# EAGLE design InkTime_Schematic (EAGLE 9.7.0)
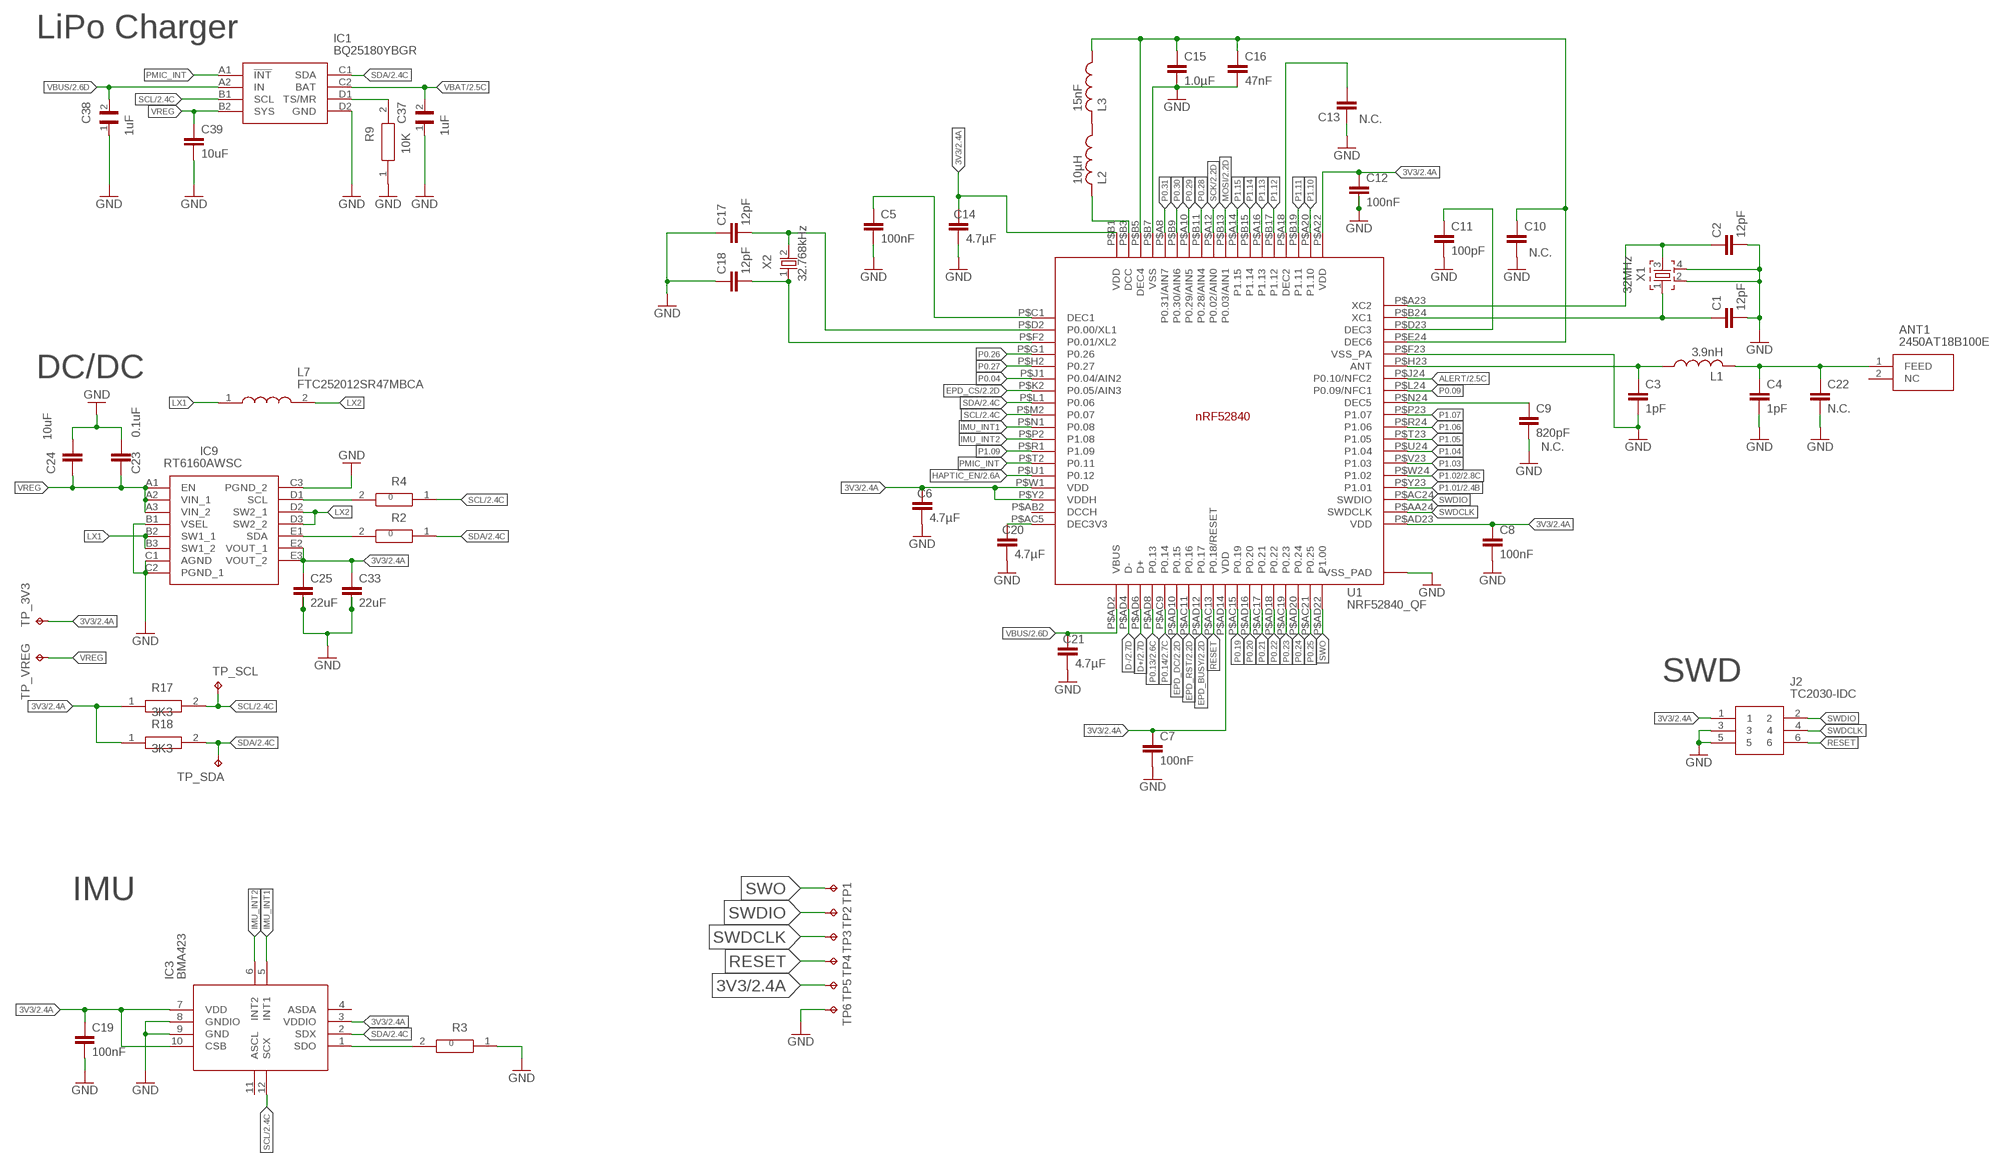
[diagram p0: schematic, sheet 1, part 1 of 2]
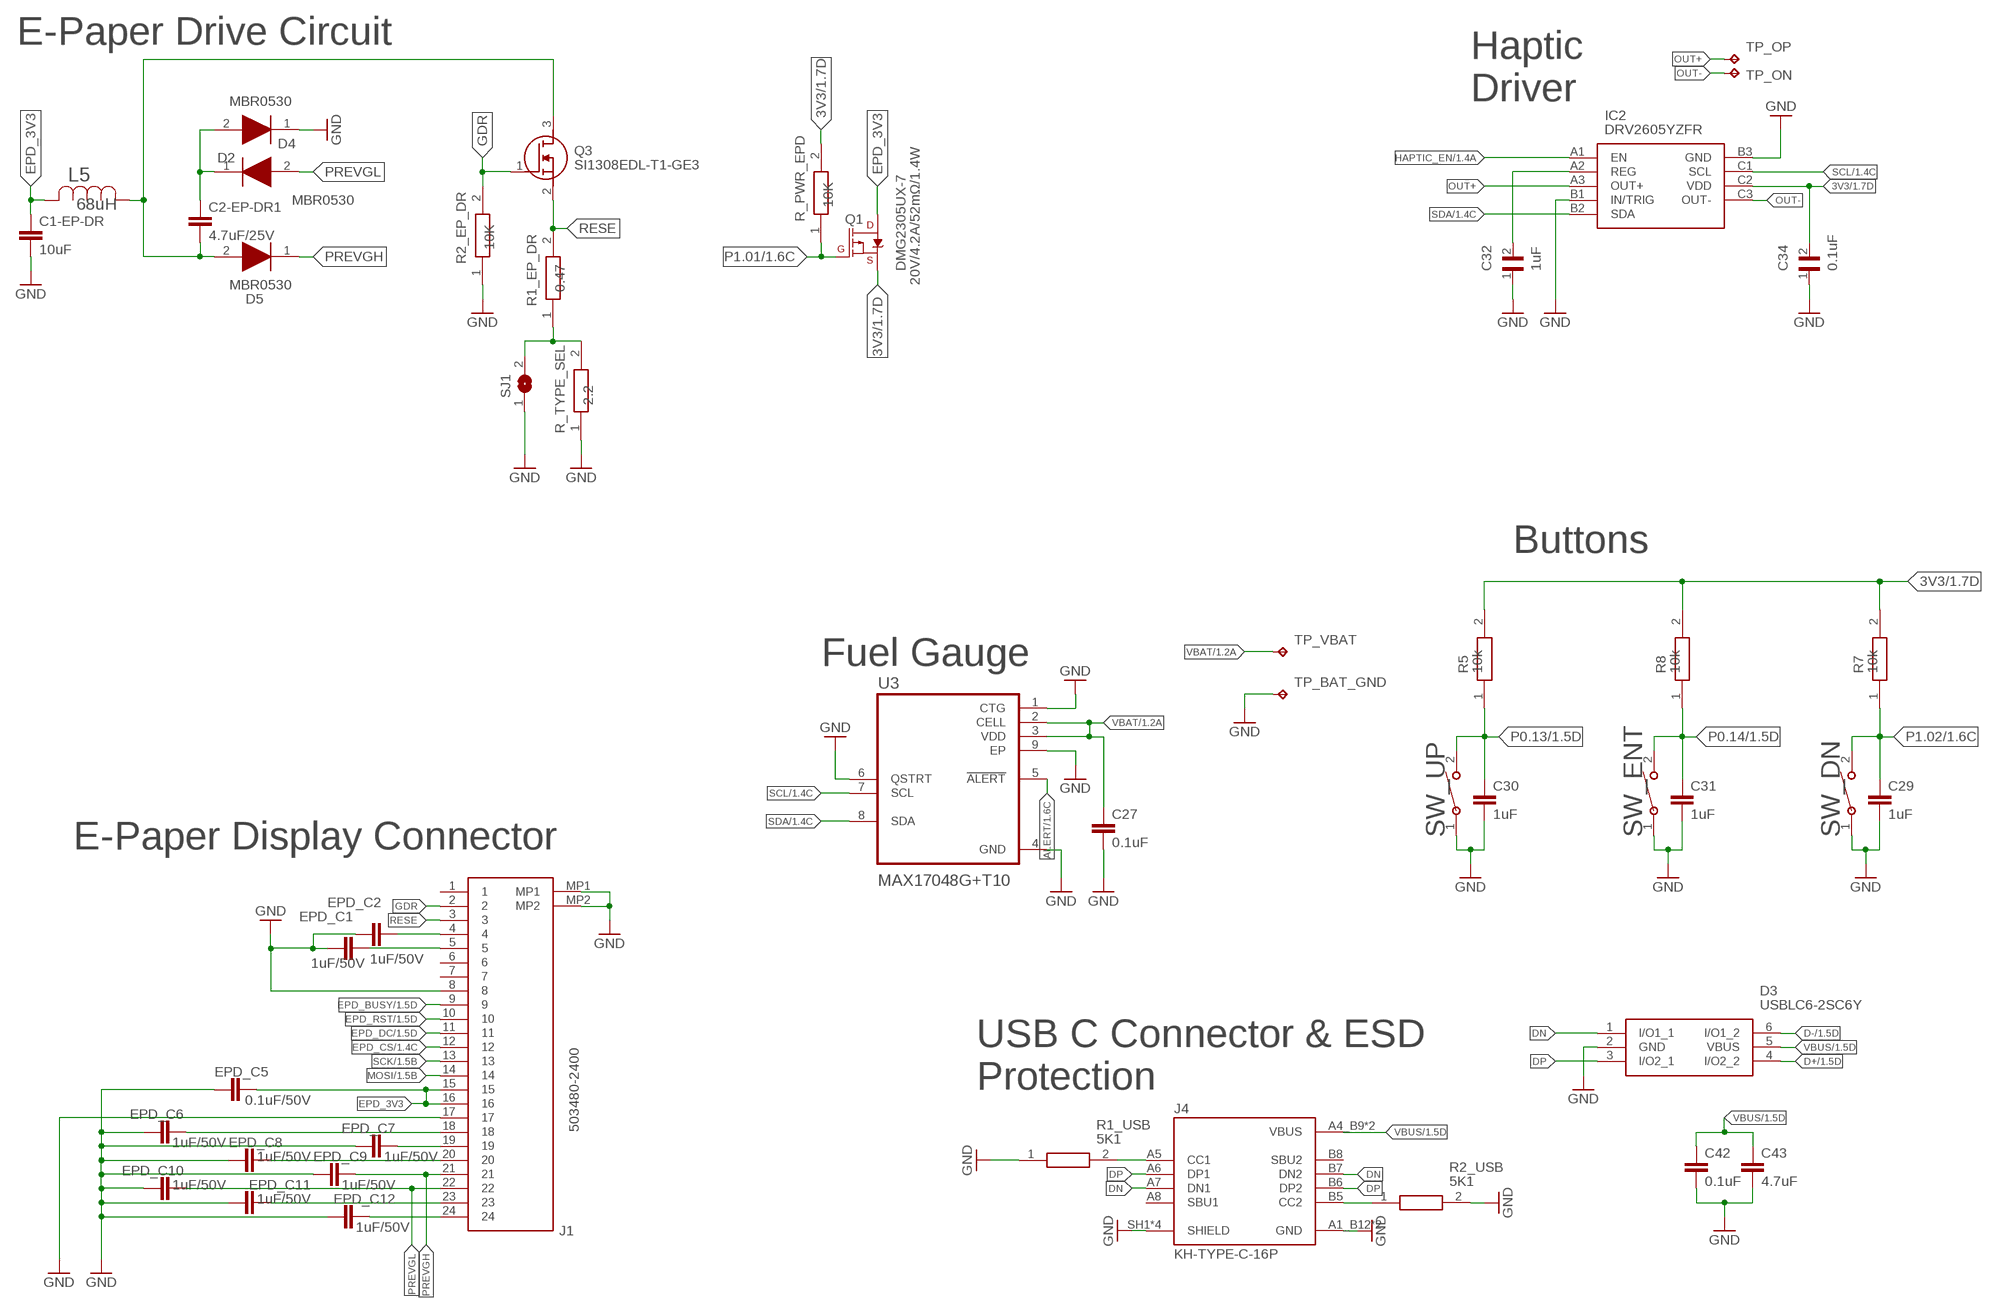
[diagram p1: schematic, sheet 1, part 2 of 2]

## Parts
ANT1  2450AT18B100E  2450AT18B100E_2450AT18B100E  [2450AT18B100E_ANTC3216X140N]
C1  12pF  NORDIC_NRF_3_CAPACITOR_0201_L  [NORDIC_NRF_3_RESC0201_L]
C1-EP-DR  10uF  NORDIC_NRF_3_CAPACITOR_0402_L  [NORDIC_NRF_3_RESC0402_L]
C2  12pF  NORDIC_NRF_3_CAPACITOR_0201_L  [NORDIC_NRF_3_RESC0201_L]
C2-EP-DR1  4.7uF/25V  NORDIC_NRF_3_CAPACITOR_0402_L  [NORDIC_NRF_3_RESC0402_L]
C3  1pF  NORDIC_NRF_3_CAPACITOR_0201_L  [NORDIC_NRF_3_RESC0201_L]
C4  1pF  NORDIC_NRF_3_CAPACITOR_0201_L  [NORDIC_NRF_3_RESC0201_L]
C5  100nF  NORDIC_NRF_3_CAPACITOR_0201_L  [NORDIC_NRF_3_RESC0201_L]
C6  4.7µF  NORDIC_NRF_3_CAPACITOR_0402_L  [NORDIC_NRF_3_RESC0402_L]
C7  100nF  NORDIC_NRF_3_CAPACITOR_0201_L  [NORDIC_NRF_3_RESC0201_L]
C8  100nF  NORDIC_NRF_3_CAPACITOR_0201_L  [NORDIC_NRF_3_RESC0201_L]
C9  820pF  NORDIC_NRF_3_CAPACITOR_0201_L  [NORDIC_NRF_3_RESC0201_L]
C10  NORDIC_NRF_3_CAPACITOR_0201_L  [NORDIC_NRF_3_RESC0201_L]
C11  100pF  NORDIC_NRF_3_CAPACITOR_0201_L  [NORDIC_NRF_3_RESC0201_L]
C12  100nF  NORDIC_NRF_3_CAPACITOR_0201_L  [NORDIC_NRF_3_RESC0201_L]
C13  NORDIC_NRF_3_CAPACITOR_0201_L  [NORDIC_NRF_3_RESC0201_L]
C14  4.7µF  NORDIC_NRF_3_CAPACITOR_0402_L  [NORDIC_NRF_3_RESC0402_L]
C15  1.0µF  NORDIC_NRF_3_CAPACITOR_0402_L  [NORDIC_NRF_3_RESC0402_L]
C16  47nF  NORDIC_NRF_3_CAPACITOR_0201_L  [NORDIC_NRF_3_RESC0201_L]
C17  12pF  NORDIC_NRF_3_CAPACITOR_0201_L  [NORDIC_NRF_3_RESC0201_L]
C18  12pF  NORDIC_NRF_3_CAPACITOR_0201_L  [NORDIC_NRF_3_RESC0201_L]
C19  100nF  NORDIC_NRF_3_CAPACITOR_0201_L  [NORDIC_NRF_3_RESC0201_L]
C20  4.7µF  NORDIC_NRF_3_CAPACITOR_0402_L  [NORDIC_NRF_3_RESC0402_L]
C21  4.7µF  NORDIC_NRF_3_CAPACITOR_0402_L  [NORDIC_NRF_3_RESC0402_L]
C22  N.C.  NORDIC_NRF_3_CAPACITOR_0201_L  [NORDIC_NRF_3_RESC0201_L]
C23  0.1uF  NORDIC_NRF_3_CAPACITOR_0201_L  [NORDIC_NRF_3_RESC0201_L]
C24  10uF  NORDIC_NRF_3_CAPACITOR_0402_L  [NORDIC_NRF_3_RESC0402_L]
C25  22uF  NORDIC_NRF_3_CAPACITOR_0402_L  [NORDIC_NRF_3_RESC0402_L]
C27  0.1uF  NORDIC_NRF_3_CAPACITOR_0201_L  [NORDIC_NRF_3_RESC0201_L]
C29  1uF  NORDIC_NRF_3_CAPACITOR_0402_L  [NORDIC_NRF_3_RESC0402_L]
C30  1uF  NORDIC_NRF_3_CAPACITOR_0402_L  [NORDIC_NRF_3_RESC0402_L]
C31  1uF  NORDIC_NRF_3_CAPACITOR_0402_L  [NORDIC_NRF_3_RESC0402_L]
C32  1uF  GRM011R60J152KE01L_2_GRM011R60J152KE01L  [GRM011R60J152KE01L_2_CAPC0201X13N]
C33  22uF  NORDIC_NRF_3_CAPACITOR_0402_L  [NORDIC_NRF_3_RESC0402_L]
C34  0.1uF  GRM011R60J152KE01L_2_GRM011R60J152KE01L  [GRM011R60J152KE01L_2_CAPC0201X13N]
C37  1uF  GRM011R60J152KE01L_2_GRM011R60J152KE01L  [GRM011R60J152KE01L_2_CAPC0201X13N]
C38  1uF  GRM011R60J152KE01L_2_GRM011R60J152KE01L  [GRM011R60J152KE01L_2_CAPC0201X13N]
C39  10uF  NORDIC_NRF_3_CAPACITOR_0402_L  [NORDIC_NRF_3_RESC0402_L]
C42  0.1uF  NORDIC_NRF_3_CAPACITOR_0201_L  [NORDIC_NRF_3_RESC0201_L]
C43  4.7uF  NORDIC_NRF_3_CAPACITOR_0402_L  [NORDIC_NRF_3_RESC0402_L]
D2  MBR0530  ESP32_C6_LIBRARY_5_MBR0530  [ESP32_C6_LIBRARY_5_SOD3716X135N]
D3  USBLC6-2SC6Y  ESP32_C6_LIBRARY_3_USBLC6-2SC6Y  [ESP32_C6_LIBRARY_3_SOT95P280X145-6N]
D4  MBR0530  ESP32_C6_LIBRARY_5_MBR0530  [ESP32_C6_LIBRARY_5_SOD3716X135N]
D5  MBR0530  ESP32_C6_LIBRARY_5_MBR0530  [ESP32_C6_LIBRARY_5_SOD3716X135N]
EPD_C1  1uF/50V  NORDIC_NRF_3_CAPACITOR_0402_L  [NORDIC_NRF_3_RESC0402_L]
EPD_C2  1uF/50V  NORDIC_NRF_3_CAPACITOR_0402_L  [NORDIC_NRF_3_RESC0402_L]
EPD_C5  0.1uF/50V  NORDIC_NRF_3_CAPACITOR_0201_L  [NORDIC_NRF_3_RESC0201_L]
EPD_C6  1uF/50V  NORDIC_NRF_3_CAPACITOR_0402_L  [NORDIC_NRF_3_RESC0402_L]
EPD_C7  1uF/50V  NORDIC_NRF_3_CAPACITOR_0402_L  [NORDIC_NRF_3_RESC0402_L]
EPD_C8  1uF/50V  NORDIC_NRF_3_CAPACITOR_0402_L  [NORDIC_NRF_3_RESC0402_L]
EPD_C9  1uF/50V  NORDIC_NRF_3_CAPACITOR_0402_L  [NORDIC_NRF_3_RESC0402_L]
EPD_C10  1uF/50V  NORDIC_NRF_3_CAPACITOR_0402_L  [NORDIC_NRF_3_RESC0402_L]
EPD_C11  1uF/50V  NORDIC_NRF_3_CAPACITOR_0402_L  [NORDIC_NRF_3_RESC0402_L]
EPD_C12  1uF/50V  NORDIC_NRF_3_CAPACITOR_0402_L  [NORDIC_NRF_3_RESC0402_L]
IC1  BQ25180YBGR  BQ25180YBGR_BQ25180YBGR  [BQ25180YBGR_BGA8C40P2X4_100X155X50]
IC2  DRV2605YZFR  DRV2605YZFR_DRV2605YZFR  [DRV2605YZFR_BGA9C50P3X3_144X144X62]
IC3  BMA423  BMA423_BMA423  [BMA423_BMA423]
IC9  RT6160AWSC  RT6160AWSC_RT6160AWSC  [RT6160AWSC_BGA15C40P3X5_140X230X60]
J1  503480-2400  503480-2400_503480-2400  [503480-2400_5034802400]
J2  TC2030-IDC  TC2030-IDC_TC2030-IDC  [TC2030-IDC_TC2030IDC]
J4  KH-TYPE-C-16P  KH-TYPE-C-16P_KH-TYPE-C-16P  [KH-TYPE-C-16P_KINGHELM_KH-TYPE-C-16P]
L1  3.9nH  NORDIC_NRF_2_INDUCTOR_0402_L  [NORDIC_NRF_2_RESC0402_L]
L2  10µH  NORDIC_NRF_2_INDUCTOR_0402_L  [NORDIC_NRF_2_RESC0402_L]
L3  15nF  NORDIC_NRF_2_INDUCTOR_0402_L  [NORDIC_NRF_2_RESC0402_L]
L5  68uH  ESP32_C6_LIBRARY_2_744043680IND_4828-WE-TPC_WRE  [ESP32_C6_LIBRARY_2_IND_4828-WE-TPC_WRE]
L7  FTC252012SR47MBCA  MLP2016SR47MT0S1_FTC252012SR47MBCA  [MLP2016SR47MT0S1_INDC2016X100N]
Q1  20V/4.2A/52mΩ/1.4W  ESP32_C6_LIBRARY_4_ESP32_WROVER_SPARKFUN-DISCRETESEMI_MOSFET_PCH-DMG2305UX-7  [ESP32_C6_LIBRARY_4_ESP32_C6_LIBRARY_4_ESP32_C6_LIBRARY_4_ESP32_C6_LIBRARY_4_ESP32_WROVER_SPARKFUN-DISCRETESEMI_SOT23-3]
Q3  SI1308EDL-T1-GE3  ESP32_C6_LIBRARY_6_SI1308EDL-T1-GE3  [ESP32_C6_LIBRARY_6_SOT65P210X110-3N]
R1_EP_DR  0.47  CPF0201D7K68C1_CPF0201D7K68C1  [CPF0201D7K68C1_0201]
R1_USB  5K1  ERA-1AEB3401C_CPF0201D7K68C1  [ERA-1AEB3401C_0201]
R2  CPF0201D7K68C1_CPF0201D7K68C1  [CPF0201D7K68C1_0201]
R2_EP_DR  10K  CPF0201D7K68C1_CPF0201D7K68C1  [CPF0201D7K68C1_0201]
R2_USB  5K1  ERA-1AEB3401C_CPF0201D7K68C1  [ERA-1AEB3401C_0201]
R3  CPF0201D7K68C1_CPF0201D7K68C1  [CPF0201D7K68C1_0201]
R4  CPF0201D7K68C1_CPF0201D7K68C1  [CPF0201D7K68C1_0201]
R5  10k  CPF0201D7K68C1_CPF0201D7K68C1  [CPF0201D7K68C1_0201]
R7  10k  CPF0201D7K68C1_CPF0201D7K68C1  [CPF0201D7K68C1_0201]
R8  10k  CPF0201D7K68C1_CPF0201D7K68C1  [CPF0201D7K68C1_0201]
R9  10K  CPF0201D7K68C1_CPF0201D7K68C1  [CPF0201D7K68C1_0201]
R17  3K3  CPF0201D7K68C1_CPF0201D7K68C1  [CPF0201D7K68C1_0201]
R18  3K3  CPF0201D7K68C1_CPF0201D7K68C1  [CPF0201D7K68C1_0201]
R_PWR_EPD  10K  CPF0201D7K68C1_CPF0201D7K68C1  [CPF0201D7K68C1_0201]
R_TYPE_SEL  2.2  CPF0201D7K68C1_CPF0201D7K68C1  [CPF0201D7K68C1_0201]
SJ1  ESP32_C6_LIBRARY_7_JUMPER_SJ  [ESP32_C6_LIBRARY_7_JUMPER_SJ]
SW_DN  2025-10-22_07-23-44_LIBRARY_EVP-AKE31ASW_EVP-AKE31A_PAN  [2025-10-22_07-23-44_LIBRARY_SW_EVP-AKE31A_PAN]
SW_ENT  SW_ENT  2025-10-22_07-23-44_LIBRARY_EVP-AKE31ASW_EVP-AKE31A_PAN  [2025-10-22_07-23-44_LIBRARY_SW_EVP-AKE31A_PAN]
SW_UP  2025-10-22_07-23-44_LIBRARY_EVP-AKE31ASW_EVP-AKE31A_PAN  [2025-10-22_07-23-44_LIBRARY_SW_EVP-AKE31A_PAN]
TP1  HECTOR_WATCH_1_TPTP20R  [HECTOR_WATCH_1_TP20R]
TP2  HECTOR_WATCH_1_TPTP20R  [HECTOR_WATCH_1_TP20R]
TP3  HECTOR_WATCH_1_TPTP20R  [HECTOR_WATCH_1_TP20R]
TP4  HECTOR_WATCH_1_TPTP20R  [HECTOR_WATCH_1_TP20R]
TP5  HECTOR_WATCH_1_TPTP20R  [HECTOR_WATCH_1_TP20R]
TP6  HECTOR_WATCH_1_TPTP20R  [HECTOR_WATCH_1_TP20R]
TP_3V3  HECTOR_WATCH_1_TPTP20R  [HECTOR_WATCH_1_TP20R]
TP_BAT_GND  HECTOR_WATCH_1_TPTP20R  [HECTOR_WATCH_1_TP20R]
TP_ON  HECTOR_WATCH_1_TPTP20R  [HECTOR_WATCH_1_TP20R]
TP_OP  HECTOR_WATCH_1_TPTP20R  [HECTOR_WATCH_1_TP20R]
TP_SCL  HECTOR_WATCH_1_TPTP20R  [HECTOR_WATCH_1_TP20R]
TP_SDA  HECTOR_WATCH_1_TPTP20R  [HECTOR_WATCH_1_TP20R]
TP_VBAT  HECTOR_WATCH_1_TPTP20R  [HECTOR_WATCH_1_TP20R]
TP_VREG  HECTOR_WATCH_1_TPTP20R  [HECTOR_WATCH_1_TP20R]
U1  NRF52840_QF  NORDIC_NRF_4_NRF52840_QF  [NORDIC_NRF_4_AQFN50P700X700X85_HS-74N]
U3  MAX17048G+T10  ESP32_C6_LIBRARY_MAX17048G+T10  [ESP32_C6_LIBRARY_SON50P200X200X80-9N]
X1  32MHz  NORDIC_NRF_XTAL_32MHZ  [NORDIC_NRF_BT-XTAL_2016_N]
X2  32.768kHz  NORDIC_NRF_1_XTAL_32KHZ  [NORDIC_NRF_1_XTAL_3215_N]

## Nets
3V3/1.7D [Power]: C34.2 IC2.C2(VDD) Q1.2(S) R5.2 R7.2 R8.2 R_PWR_EPD.2
3V3/2.4A [Power]: C6.1 C7.1 C8.1 C12.1 C14.1 C19.1 C25.1 C33.1 IC3.3(VDDIO) IC3.7(VDD) IC3.10(CSB) IC9.E2(VOUT_1) IC9.E3(VOUT_2) J2.1 R17.1 R18.1 TP5.TP TP_3V3.TP U1.P$A22(VDD) U1.P$AD14(VDD) U1.P$AD23(VDD) U1.P$B1(VDD) U1.P$W1(VDD) U1.P$Y2(VDDH)
ALERT/1.6C: U3.5(!ALERT)
ALERT/2.5C: U1.P$J24(P0.10/NFC2)
D+/1.5D: D3.4(I/O2_2)
D+/2.7D: U1.P$AD6(D+)
D-/1.5D: D3.6(I/O1_2)
D-/2.7D: U1.P$AD4(D-)
DN: D3.1(I/O1_1) J4.A7(DN1) J4.B7(DN2)
DP: D3.3(I/O2_1) J4.A6(DP1) J4.B6(DP2)
EPD_3V3 [Power]: C1-EP-DR.1 EPD_C5.2 J1.15 J1.16 L5.2 Q1.3(D)
EPD_BUSY/1.5D: J1.9
EPD_BUSY/2.2D: U1.P$AD12(P0.17)
EPD_CS/1.4C: J1.12
EPD_CS/2.2D: U1.P$K2(P0.05/AIN3)
EPD_DC/1.5D: J1.11
EPD_DC/2.2D: U1.P$AD10(P0.15)
EPD_RST/1.5D: J1.10
EPD_RST/2.2D: U1.P$AC11(P0.16)
GDR [Power]: J1.2 Q3.1(G) R2_EP_DR.2
GND [Power]: C1-EP-DR.2 C1.2 C2.2 C3.2 C4.2 C5.2 C6.2 C7.2 C8.2 C9.2 C10.1 C11.2 C12.2 C13.1 C14.2 C15.2 C16.2 C17.1 C18.1 C19.2 C20.2 C21.2 C22.2 C23.1 C24.1 C25.2 C27.2 C29.2 C30.2 C31.2 C32.1 C33.2 C34.1 C37.1 C38.1 C39.2 C42.2 C43.2 D2.1(K) D3.2(GND) EPD_C1.1 EPD_C2.1 EPD_C5.1 EPD_C6.1 EPD_C7.1 EPD_C8.1 EPD_C9.1 EPD_C10.1 EPD_C11.1 EPD_C12.1 IC1.D2(GND) IC2.B1(IN/TRIG) IC2.B3(GND) IC3.8(GNDIO) IC3.9(GND) IC9.B1(VSEL) IC9.C1(AGND) IC9.C2(PGND_1) IC9.C3(PGND_2) J1.8 J1.17 J1.MP1 J1.MP2 J2.3 J2.5 J4.A1_B12(GND) J4.A12_B1(GND) J4.SH1(SHIELD) J4.SH2(SHIELD) J4.SH3(SHIELD) J4.SH4(SHIELD) R1_USB.1 R2_EP_DR.1 R2_USB.2 R3.1 R9.1 R_TYPE_SEL.1 SJ1.1 SW_DN.1 SW_ENT.1 SW_UP.1 TP6.TP TP_BAT_GND.TP U1.P$74(VSS_PAD) U1.P$75(VSS_PAD) U1.P$76(VSS_PAD) U1.P$77(VSS_PAD) U1.P$78(VSS_PAD) U1.P$79(VSS_PAD) U1.P$80(VSS_PAD) U1.P$81(VSS_PAD) U1.P$82(VSS_PAD) U1.P$83(VSS_PAD) U1.P$84(VSS_PAD) U1.P$85(VSS_PAD) U1.P$86(VSS_PAD) U1.P$87(VSS_PAD) U1.P$88(VSS_PAD) U1.P$89(VSS_PAD) U1.P$90(VSS_PAD) U1.P$B7(VSS) U1.P$F23(VSS_PA) U3.1(CTG) U3.4(GND) U3.6(QSTRT) U3.9(EP) X1.2 X1.4
HAPTIC_EN/1.4A: IC2.A1(EN)
HAPTIC_EN/2.6A: U1.P$U1(P0.12)
IMU_INT1: IC3.5(INT1) U1.P$N1(P0.08)
IMU_INT2: IC3.6(INT2) U1.P$P2(P1.08)
LX1 [Power]: IC9.B2(SW1_1) IC9.B3(SW1_2) L7.1
LX2 [Power]: IC9.D2(SW2_1) IC9.D3(SW2_2) L7.2
MOSI/1.5B: J1.14
MOSI/2.2D: U1.P$B13(P0.03/AIN1)
N$1: C5.1 U1.P$C1(DEC1)
N$2: C9.1 U1.P$N24(DEC5)
N$3: C11.1 U1.P$D23(DEC3)
N$4: IC9.D1(SCL) R4.2
N$5: C17.2 U1.P$D2(P0.00/XL1) X2.2
N$6: C18.2 U1.P$F2(P0.01/XL2) X2.1
N$7: C2-EP-DR1.2 D5.2(A) L5.1 Q3.3(D)
N$9: C3.1 L1.1 U1.P$H23(ANT)
N$10: ANT1.1(FEED) C4.1 C22.1 L1.2
N$12: C10.2 C15.1 C16.1 L3.1 U1.P$B5(DEC4) U1.P$E24(DEC6)
N$13: C2.1 U1.P$A23(XC2) X1.3
N$14: C1.1 U1.P$B24(XC1) X1.1
N$15: L2.1 L3.2
N$16: L2.2 U1.P$B3(DCC)
N$17: C13.2 U1.P$A18(DEC2)
N$18: IC3.1(SDO) R3.2
N$19: C20.1 U1.P$AC5(DEC3V3)
N$21: IC9.E1(SDA) R2.2
N$23: EPD_C8.2 J1.20
N$24: IC1.D1(TS/MR) R9.2
N$25: C2-EP-DR1.1 D2.2(A) D4.1(K)
N$27: EPD_C2.2 J1.4
N$29: R1_EP_DR.1 R_TYPE_SEL.2 SJ1.2
N$31: EPD_C1.2 J1.5
N$32: C32.2 IC2.A2(REG)
N$34: J4.B5(CC2) R2_USB.1
N$37: J4.A5(CC1) R1_USB.2
N$39: EPD_C7.2 J1.19
N$41: EPD_C6.2 J1.18
N$42: EPD_C11.2 J1.23
N$44: EPD_C12.2 J1.24
OUT+ [Power]: IC2.A3(OUT+) TP_OP.TP
OUT- [Power]: IC2.C3(OUT-) TP_ON.TP
P0.04: U1.P$J1(P0.04/AIN2)
P0.09: U1.P$L24(P0.09/NFC1)
P0.13/1.5D: C30.1 R5.1 SW_UP.2
P0.13/2.6C: U1.P$AD8(P0.13)
P0.14/1.5D: C31.1 R8.1 SW_ENT.2
P0.14/2.7C: U1.P$AC9(P0.14)
P0.19: U1.P$AC15(P0.19)
P0.20: U1.P$AD16(P0.20)
P0.21: U1.P$AC17(P0.21)
P0.22: U1.P$AD18(P0.22)
P0.23: U1.P$AC19(P0.23)
P0.24: U1.P$AD20(P0.24)
P0.25: U1.P$AC21(P0.25)
P0.26: U1.P$G1(P0.26)
P0.27: U1.P$H2(P0.27)
P0.28: U1.P$B11(P0.28/AIN4)
P0.29: U1.P$A10(P0.29/AIN5)
P0.30: U1.P$B9(P0.30/AIN6)
P0.31: U1.P$A8(P0.31/AIN7)
P1.01/1.6C: Q1.1(G) R_PWR_EPD.1
P1.01/2.4B: U1.P$Y23(P1.01)
P1.02/1.6C: C29.1 R7.1 SW_DN.2
P1.02/2.8C: U1.P$W24(P1.02)
P1.03: U1.P$V23(P1.03)
P1.04: U1.P$U24(P1.04)
P1.05: U1.P$T23(P1.05)
P1.06: U1.P$R24(P1.06)
P1.07: U1.P$P23(P1.07)
P1.09: U1.P$R1(P1.09)
P1.10: U1.P$A20(P1.10)
P1.11: U1.P$B19(P1.11)
P1.12: U1.P$B17(P1.12)
P1.13: U1.P$A16(P1.13)
P1.14: U1.P$B15(P1.14)
P1.15: U1.P$A14(P1.15)
PMIC_INT: IC1.A1(!INT) U1.P$T2(P0.11)
PREVGH [Power]: D5.1(K) EPD_C9.2 J1.21
PREVGL [Power]: D4.2(A) EPD_C10.2 J1.22
RESE [Power]: J1.3 Q3.2(S) R1_EP_DR.2
RESET: J2.6 TP4.TP U1.P$AC13(P0.18/RESET)
SCK/1.5B: J1.13
SCK/2.2D: U1.P$A12(P0.02/AIN0)
SCL/1.4C: IC2.C1(SCL) U3.7(SCL)
SCL/2.4C: IC1.B1(SCL) IC3.12(SCX) R4.1 R17.2 TP_SCL.TP U1.P$M2(P0.07)
SDA/1.4C: IC2.B2(SDA) U3.8(SDA)
SDA/2.4C: IC1.C1(SDA) IC3.2(SDX) R2.1 R18.2 TP_SDA.TP U1.P$L1(P0.06)
SWDCLK: J2.4 TP3.TP U1.P$AA24(SWDCLK)
SWDIO: J2.2 TP2.TP U1.P$AC24(SWDIO)
SWO: TP1.TP U1.P$AD22(P1.00)
VBAT/1.2A [Power]: C27.1 TP_VBAT.TP U3.2(CELL) U3.3(VDD)
VBAT/2.5C [Power]: C37.2 IC1.C2(BAT)
VBUS/1.5D [Power]: C42.1 C43.1 D3.5(VBUS) J4.A4_B9(VBUS) J4.A9_B4(VBUS)
VBUS/2.6D [Power]: C21.1 C38.2 IC1.A2(IN) U1.P$AD2(VBUS)
VREG [Power]: C23.2 C24.2 C39.1 IC1.B2(SYS) IC9.A1(EN) IC9.A2(VIN_1) IC9.A3(VIN_2) TP_VREG.TP
Unconnected: ANT1.2(NC) IC3.4(ASDA) IC3.11(ASCL) J1.1 J1.6 J1.7 J4.A8(SBU1) J4.B8(SBU2) U1.P$AB2(DCCH)

## Notes on the sheet
- LiPo Charger
- N.C.
- N.C.
- DC/DC
- N.C.
- 0
- 0
- SWD
- IMU
- 0
- E-Paper Drive Circuit
- Haptic
  Driver
- DMG2305UX-7
- Buttons
- Fuel Gauge
- E-Paper Display Connector
- USB C Connector & ESD
  Protection

## Library data of the parts
ANT1 = InkTime_v5:2450AT18B100E_2450AT18B100E: Antennas 2.45GHz ANTENNA Source: Datasheet <https://www.johansontechnology.com/datasheets/2450AT18B100/2450AT18B100.pdf>; ARROW_PART_NUMBER: 2450AT18B100E; ARROW_PRICE-STOCK: https://www.arrow.com/en/products/2450at18b100e/johanson-dielectrics?utm_currency=USD&region=nac; DESCRIPTION: Antennas 2.45GHz ANTENNA; HEIGHT: 1.4mm; MANUFACTURER_NAME: JOHANSON TECHNOLOGY; MANUFACTURER_PART_NUMBER: 2450AT18B100E; MOUSER_PART_NUMBER: 609-2450AT18B100E; MOUSER_PRICE-STOCK: https://www.mouser.co.uk/ProductDetail/Johanson-Technology/2450AT18B100E?qs=yCnrNFeXz%252Bh5MFsFIXGZGA%3D%3D
C1 C1-EP-DR C2 C2-EP-DR1 C3-C25 C27 C29-C31 C33 C39 C42 C43 EPD_C1 EPD_C2 EPD_C5-EPD_C12 = InkTime_v5:NORDIC_NRF_3_CAPACITOR: Generic chip capacitor
C32 C34 C37 C38 = InkTime_v5:GRM011R60J152KE01L_2_GRM011R60J152KE01L: Check availability <https://pricing.snapeda.com/parts/GRM011R60J152KE01L/Murata/view-part?ref=eda>; AVAILABILITY: In Stock; CHECK_PRICES: https://www.snapeda.com/parts/GRM011R60J152KE01L/Murata/view-part/?ref=eda; DESCRIPTION: SMD Capacitor X5R(EIA) with Capacitance: 1500pF Tol. 10%. Rated Voltage: 6.3Vdc; MF: Murata; MP: GRM011R60J152KE01L; PACKAGE: 0201 Murata; PRICE: None; SNAPEDA_LINK: https://www.snapeda.com/parts/GRM011R60J152KE01L/Murata/view-part/?ref=snap
D2 D4 D5 = InkTime_v5:ESP32_C6_LIBRARY_5_MBR0530: ON SEMICONDUCTOR - MBR0530 - DIODE, SCHOTTKY, 0.5A, 30V, SOD-123 Source: Datasheet <http://www.onsemi.com/pub/Collateral/MBR0530T1-D.PDF> Check availability <https://pricing.snapeda.com/parts/MBR0530/ON%20Semiconductor/view-part?ref=eda>; AVAILABILITY: In Stock; CHECK_PRICES: https://www.snapeda.com/parts/MBR0530/Onsemi/view-part/?ref=eda; DESCRIPTION: Diode Schottky 30 V 500mA Surface Mount SOD-123; MF: ON Semiconductor; MP: MBR0530; PACKAGE: SOD-123-2 ON Semiconductor; PRICE: None; PURCHASE-URL: https://www.snapeda.com/api/url_track_click_mouser/?unipart_id=179458&manufacturer=ON Semiconductor&part_name=MBR0530&search_term=None; SNAPEDA_LINK: https://www.snapeda.com/parts/MBR0530/Onsemi/view-part/?ref=snap
D3 = InkTime_v5:ESP32_C6_LIBRARY_3_USBLC6-2SC6Y: Low Cap. ESD Protection Auto SOT-23-6 STMicroelectronics USBLC6-2SC6Y, Dual Uni-Directional TVS Diode Array, 6-Pin SOT-23 Source: Datasheet <https://componentsearchengine.com/Datasheets/1/USBLC6-2SC6Y.pdf> Check availability <https://pricing.snapeda.com/parts/USBLC6-2SC6Y/STMicroelectronics/view-part?ref=eda>; AVAILABILITY: In Stock; CHECK_PRICES: https://www.snapeda.com/parts/USBLC6-2SC6Y/STMicroelectronics/view-part/?ref=eda; DESCRIPTION: 17V Clamp 5A (8/20µs) Ipp Tvs Diode Surface Mount SOT-23-6; MF: STMicroelectronics; MP: USBLC6-2SC6Y; PACKAGE: SOT-23-6 STMicroelectronics; PRICE: None; SNAPEDA_LINK: https://www.snapeda.com/parts/USBLC6-2SC6Y/STMicroelectronics/view-part/?ref=snap
IC1 = InkTime_v5:BQ25180YBGR_BQ25180YBGR: Charger IC Lithium Ion/Polymer, Lithium Iron Phosphate 8-DSBGA (1.6x1.1) Source: Datasheet <https://www.ti.com/lit/ds/symlink/bq25180.pdf?ts=1650264094470&ref_url=https%3A%2F%2Fwww.ti.com%2Fproduct%2FBQ25180>; ARROW_PART_NUMBER: BQ25180YBGR; ARROW_PRICE-STOCK: https://www.arrow.com/en/products/bq25180ybgr/texas-instruments?utm_currency=USD&region=nac; DESCRIPTION: Charger IC Lithium Ion/Polymer, Lithium Iron Phosphate 8-DSBGA (1.6x1.1); HEIGHT: 0.5mm; MANUFACTURER_NAME: Texas Instruments; MANUFACTURER_PART_NUMBER: BQ25180YBGR; MOUSER_PART_NUMBER: 595-BQ25180YBGR; MOUSER_PRICE-STOCK: https://www.mouser.co.uk/ProductDetail/Texas-Instruments/BQ25180YBGR?qs=doiCPypUmgEWjAK%252BJAX6Tw%3D%3D
IC2 = InkTime_v5:DRV2605YZFR_DRV2605YZFR: Haptic Driver for ERM/LRA with Built-In Library and Smart Loop Architecture Source: Datasheet <http://www.ti.com/lit/gpn/drv2605>; ARROW_PART_NUMBER: DRV2605YZFR; ARROW_PRICE-STOCK: https://www.arrow.com/en/products/drv2605yzfr/texas-instruments?region=nac; DESCRIPTION: Haptic Driver for ERM/LRA with Built-In Library and Smart Loop Architecture; HEIGHT: 0.625mm; MANUFACTURER_NAME: Texas Instruments; MANUFACTURER_PART_NUMBER: DRV2605YZFR
IC3 = InkTime_v5:BMA423_BMA423: Accelerometers Triaxial low-g 12bit Acceleration Sensor Source: Datasheet <https://www.mouser.com/datasheet/2/783/BST-BMA423-DS000-1509600.pdf>; ARROW_PART_NUMBER: BMA423; ARROW_PRICE-STOCK: https://www.arrow.com/en/products/bma423/bosch; DESCRIPTION: Accelerometers Triaxial low-g 12bit Acceleration Sensor; HEIGHT: 1mm; MANUFACTURER_NAME: BOSCH; MANUFACTURER_PART_NUMBER: BMA423; MOUSER_PART_NUMBER: 262-BMA423; MOUSER_PRICE-STOCK: https://www.mouser.co.uk/ProductDetail/Bosch-Sensortec/BMA423?qs=HXFqYaX1Q2xC%252BSgeGoX3mg%3D%3D
IC9 = InkTime_v5:RT6160AWSC_RT6160AWSC: Buck-Boost Regulator Positive Output Step-Up/Step-Down I2C DC-DC Controller IC 15-WL-CSP (BSC) (1.4x2.3) Source: Datasheet <https://www.richtek.com/SaveDownload.aspx?specid=RT6160A>; DESCRIPTION: Buck-Boost Regulator Positive Output Step-Up/Step-Down I2C DC-DC Controller IC 15-WL-CSP (BSC) (1.4x2.3); HEIGHT: 0.6mm; MANUFACTURER_NAME: RICHTEK; MANUFACTURER_PART_NUMBER: RT6160AWSC; MOUSER_PART_NUMBER: 835-RT6160AWSC; MOUSER_PRICE-STOCK: https://www.mouser.co.uk/ProductDetail/Richtek/RT6160AWSC?qs=amGC7iS6iy%2FLd9PSoixZXQ%3D%3D
J1 = InkTime_v5:503480-2400_503480-2400: FFC & FPC Connectors 0.5mm FPC RA SMT Dual Contact 24Ckt Source: Datasheet <https://componentsearchengine.com/Datasheets/1/503480-2400.pdf>; DESCRIPTION: FFC & FPC Connectors 0.5mm FPC RA SMT Dual Contact 24Ckt; HEIGHT: 1.87mm; MANUFACTURER_NAME: Molex; MANUFACTURER_PART_NUMBER: 503480-2400; MOUSER_PART_NUMBER: 538-503480-2400; MOUSER_PRICE-STOCK: https://www.mouser.co.uk/ProductDetail/Molex/503480-2400?qs=OAhjpuo3Vu7efIoxFh9AOw%3D%3D
J2 = InkTime_v5:TC2030-IDC_TC2030-IDC: CABLE ADAPTER 6 POS Source: Datasheet <https://datasheet.datasheetarchive.com/originals/distributors/Datasheets_SAMA/62bc384e093448baaaa63dbd0b9d8707.pdf>; DESCRIPTION: CABLE ADAPTER 6 POS; HEIGHT: 19mm; MANUFACTURER_NAME: Tag Connect; MANUFACTURER_PART_NUMBER: TC2030-IDC
J4 = InkTime_v5:KH-TYPE-C-16P_KH-TYPE-C-16P: Check availability <https://pricing.snapeda.com/parts/KH-TYPE-C-16P/kinghelm/view-part?ref=eda>; AVAILABILITY: Not in stock; CHECK_PRICES: https://www.snapeda.com/parts/KH-TYPE-C-16P/Kinghelm/view-part/?ref=eda; MF: kinghelm; MP: KH-TYPE-C-16P; PACKAGE: None; PRICE: None; SNAPEDA_LINK: https://www.snapeda.com/parts/KH-TYPE-C-16P/Kinghelm/view-part/?ref=snap
L1-L3 = InkTime_v5:NORDIC_NRF_2_INDUCTOR: Generic chip inductor
L5 = InkTime_v5:ESP32_C6_LIBRARY_2_744043680; COPYRIGHT: Copyright (C) 2024 Ultra Librarian. All rights reserved.; MANUFACTURER_PART_NUMBER: 744043680; MFR_NAME: Wurth Electronics
L7 = InkTime_v5:MLP2016SR47MT0S1_FTC252012SR47MBCA: SMD / SMT Inductors (Coils), L=0.47?H, L x W x T : Source: Datasheet <https://product.tdk.com/system/files/dam/doc/product/inductor/inductor/smd/catalog/inductor_commercial_power_mlp2016_en.pdf>; DESCRIPTION: SMD / SMT Inductors (Coils), L=0.47?H, L x W x T :; HEIGHT: 1mm; JLCPCB: https://jlcpcb.com/partdetail/6763488-FTC252012SR47MBCA/C5832368; MANUFACTURER_NAME: TDK; MANUFACTURER_PART_NUMBER: FTC252012SR47MBCA
Q1 = InkTime_v5:ESP32_C6_LIBRARY_4_ESP32_WROVER_SPARKFUN-DISCRETESEMI_MOSFET_PCH: P-channel MOSFETs Voltage controlled devices that allow control of high current outputs. SparkFun Products: SparkFun ESP32 Thing <https://www.sparkfun.com/products/13907> SparkFun ESP8266 Thing <https://www.sparkfun.com/products/13231> SparkFun Pi Servo HAT V2 <https://www.sparkfun.com/products/15316> DMG2305UX-7 (20V/4.2A/SOT23-3); PROD_ID: TRAN-14388
Q3 = InkTime_v5:ESP32_C6_LIBRARY_6_SI1308EDL-T1-GE3: MOSFET N-Ch 30V 1.5A TrenchFET SC70 Vishay Si1308EDL-T1-GE3 N-channel MOSFET Transistor, 1.5 A, 30 V, 3-Pin SC-70 Source: Datasheet <https://componentsearchengine.com/Datasheets/1/SI1308EDL-T1-GE3.pdf> Check availability <https://pricing.snapeda.com/parts/SI1308EDL-T1-GE3/Vishay%20Siliconix/view-part?ref=eda>; AVAILABILITY: In Stock; CHECK_PRICES: https://www.snapeda.com/parts/SI1308EDL-T1-GE3/Vishay+Siliconix/view-part/?ref=eda; DESCRIPTION: Si1308EDL-T1-GE3 N-channel MOSFET Transistor, 1.5 A, 30 V, 3-Pin SC-70 | Siliconix / Vishay SI1308EDL-T1-GE3; MF: Vishay Siliconix; MP: SI1308EDL-T1-GE3; PACKAGE: SOT-323 Vishay Semiconductor; PRICE: None; PURCHASE-URL: https://www.snapeda.com/api/url_track_click_mouser/?unipart_id=274603&manufacturer=Vishay Siliconix&part_name=SI1308EDL-T1-GE3&search_term=None; SNAPEDA_LINK: https://www.snapeda.com/parts/SI1308EDL-T1-GE3/Vishay+Siliconix/view-part/?ref=snap
R1_EP_DR R2 R2_EP_DR R3-R5 R7-R9 R17 R18 R_PWR_EPD R_TYPE_SEL = InkTime_v5:CPF0201D7K68C1_CPF0201D7K68C1: 7.68k 0201 Thin Film Surface Mount Fixed Resistor +/-0.5% 0.031W CPF0201D7K68C1 Source: Datasheet <http://www.te.com/commerce/DocumentDelivery/DDEController?Action=showdoc&DocId=Data Sheet1773200-1ApdfEnglishENG_DS_1773200-1_A.pdf4-2176215-6>
R1_USB R2_USB = InkTime_v5:ERA-1AEB3401C_CPF0201D7K68C1: 7.68k 0201 Thin Film Surface Mount Fixed Resistor +/-0.5% 0.031W CPF0201D7K68C1 Source: Datasheet <http://www.te.com/commerce/DocumentDelivery/DDEController?Action=showdoc&DocId=Data Sheet1773200-1ApdfEnglishENG_DS_1773200-1_A.pdf4-2176215-6>
SJ1 = InkTime_v5:ESP32_C6_LIBRARY_7_JUMPER_SJ: SMD solder JUMPER
SW_DN SW_ENT SW_UP = InkTime_v5:2025-10-22_07-23-44_LIBRARY_EVP-AKE31A; COPYRIGHT: Copyright (C) 2025 Ultra Librarian. All rights reserved.; DIGI-KEY_PART_NUMBER_1: P123437TR-ND; DIGI-KEY_PART_NUMBER_2: P123437CT-ND; DIGI-KEY_PART_NUMBER_3: P123437DKR-ND; MANUFACTURER_NAME: Panasonic; MANUFACTURER_PART_NUMBER: EVP-AKE31A
TP1-TP6 TP_3V3 TP_BAT_GND TP_ON TP_OP TP_SCL TP_SDA TP_VBAT TP_VREG = InkTime_v5:HECTOR_WATCH_1_TP: Test pad
U1 = InkTime_v5:NORDIC_NRF_4_NRF52840_QF: nRF52840 Features Advanced Single chip 2.4 GHz multi-protocol SoC 32-bit ARM Cortex-M4F Processor 1.7v to 5.5v operation 1MB flash + 256kB RAM Bluetooth 5 support for long range and high throughput 802.15.4 radio support On-chip NFC PPI –Programmable Peripheral Interconnect Automated power management system with automatic power management of each peripheral Configurable I/O mapping for analog and digital I/O 48 x GPIO 1 x QSPI 4 x Master/Slave SPI 2 x Two-wire interface (I²C) I²S interface 2 x UART 4 x PWM USB 2.0 controller ARM TrustZone CryptoCell-310 Cryptographic and security module AES 128-bit ECB/CCM/AAR hardware accelerator Digital microphone interface (PDM) Quadrature decoder 12-bit ADC Low power comparator On-chip 50Ω balun On-air compatible with nRF52, nRF51 and nRF24 Series Applications Advanced high performance wearables Wearables for secure payments Virtual Reality/Augmented Reality systems Smart Home sensor networks Smart city sensor networks High performance HID controllers Internet of Things (IoT) sensor networks Smart door locks Smart lighting networks Connected white goods
U3 = InkTime_v5:ESP32_C6_LIBRARY_MAX17048G+T10: Check availability <https://pricing.snapeda.com/parts/MAX17048G%2BT10/Analog%20Devices/view-part?ref=eda>; AVAILABILITY: In Stock; CHECK_PRICES: https://www.snapeda.com/parts/MAX17048G+T10/Analog+Devices/view-part/?ref=eda; DESCRIPTION: 3µA 1-Cell/2-Cell Fuel Gauge with ModelGauge; MF: Analog Devices; MP: MAX17048G+T10; PACKAGE: TDFN-8 Maxim; PRICE: None; PURCHASE-URL: https://www.snapeda.com/api/url_track_click_mouser/?unipart_id=329239&manufacturer=Analog Devices&part_name=MAX17048G+T10&search_term=None; SNAPEDA_LINK: https://www.snapeda.com/parts/MAX17048G+T10/Analog+Devices/view-part/?ref=snap
X1 = InkTime_v5:NORDIC_NRF_XTAL_32MHZ
X2 = InkTime_v5:NORDIC_NRF_1_XTAL_32KHZ

## Net classes
1 Power: width 0.3 mm

## Board
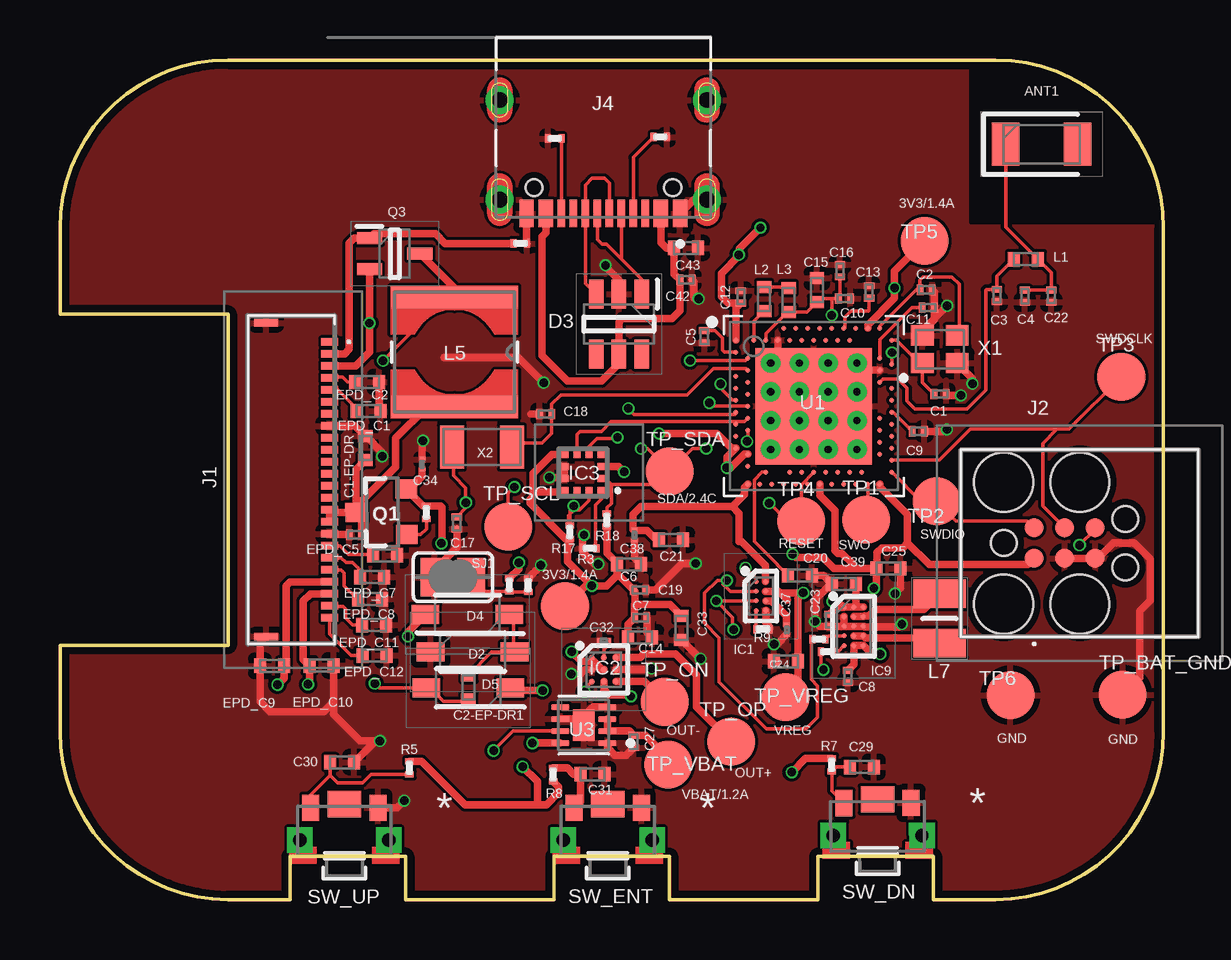
[diagram p2: board, top side]
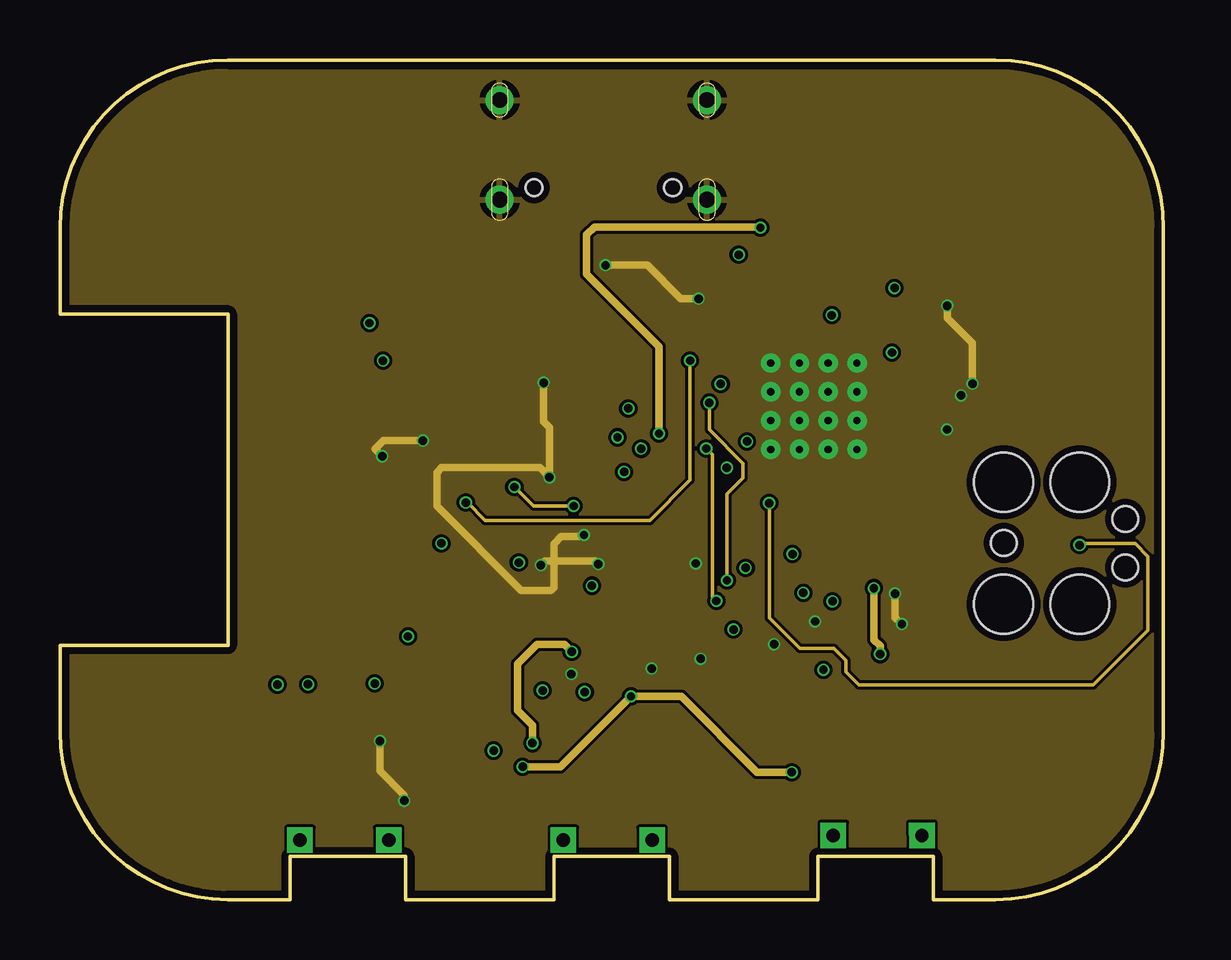
[diagram p3: board, inner layer Route2]
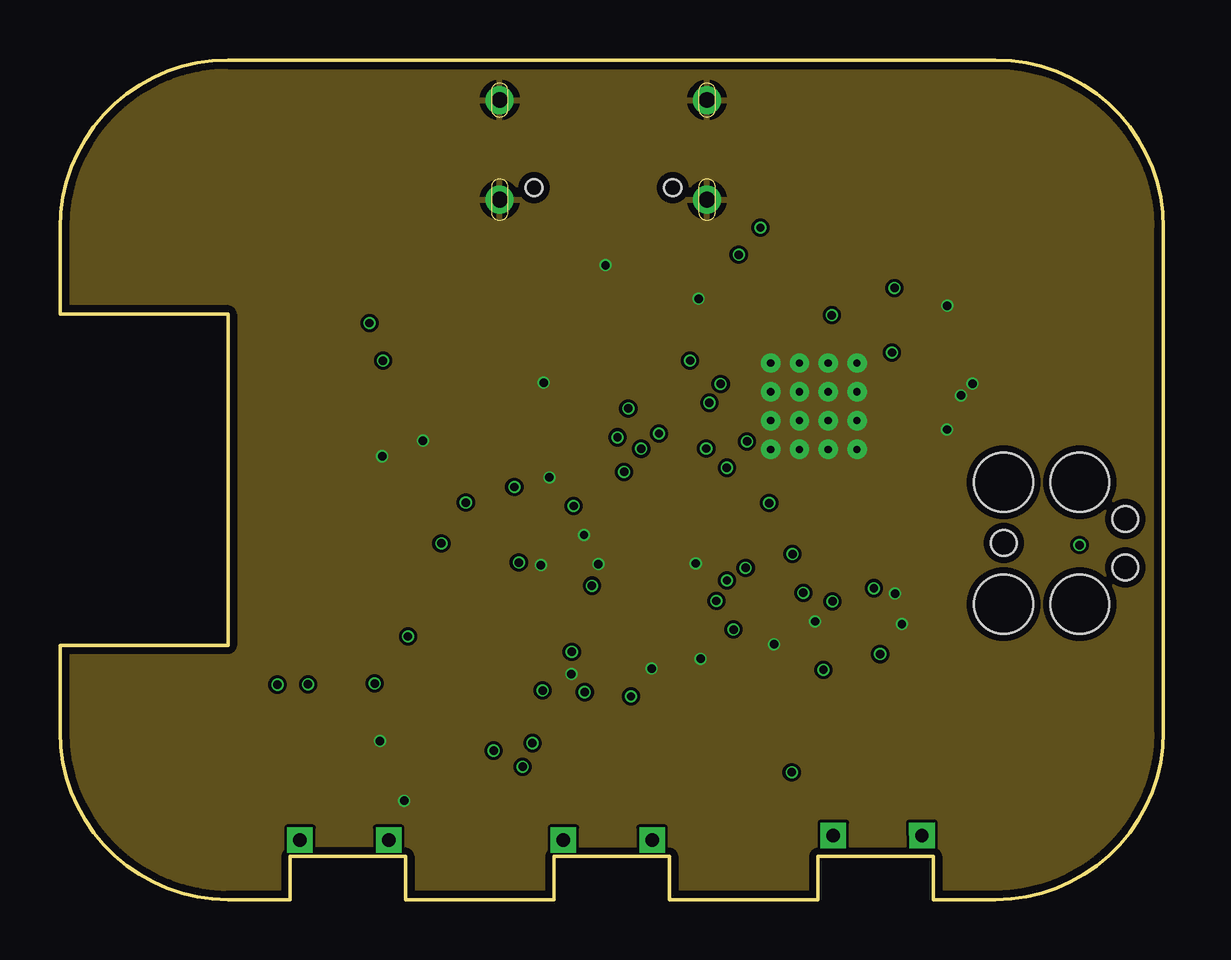
[diagram p4: board, inner layer Route15]
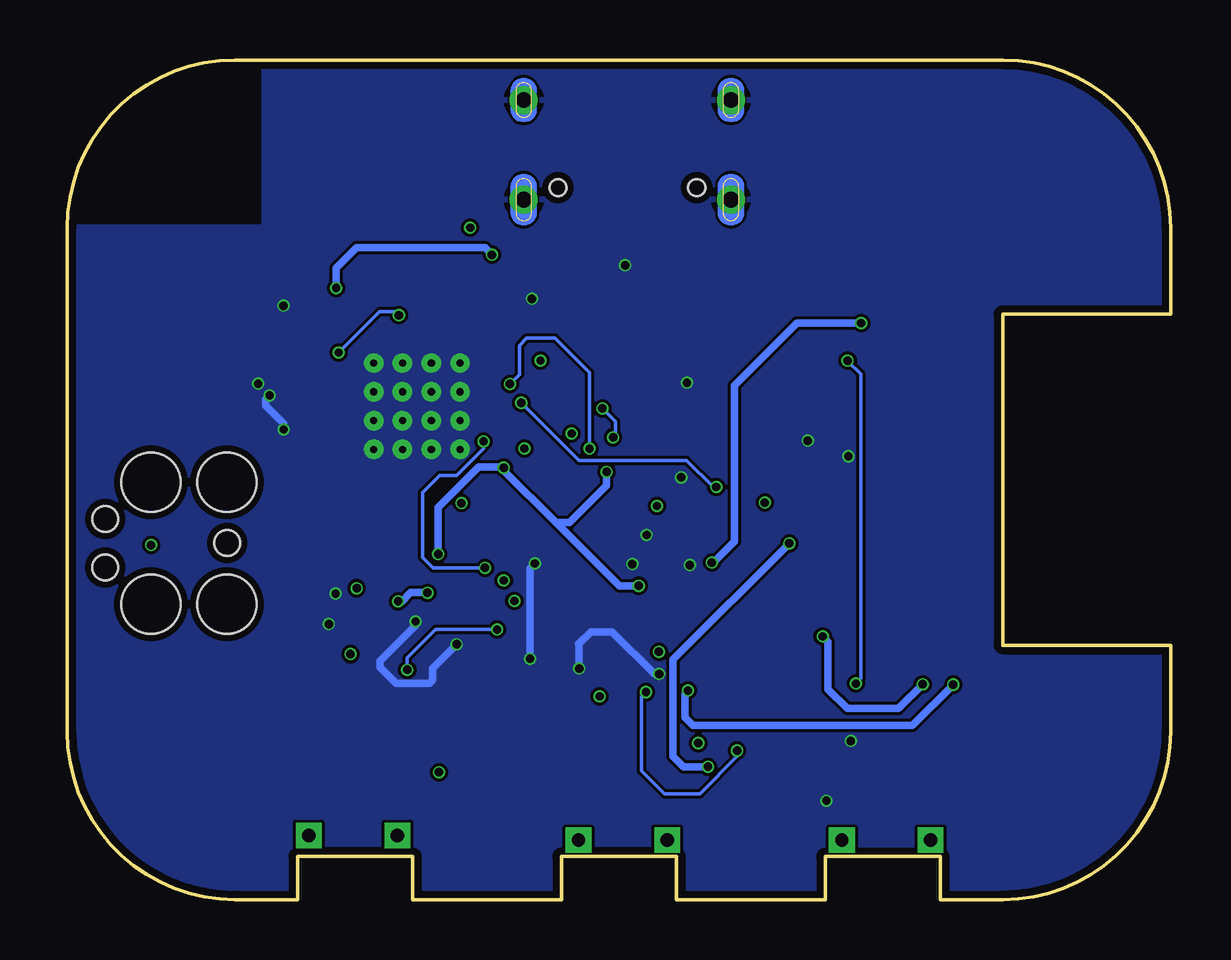
[diagram p5: board, bottom side, seen from below]

Size 46 x 35 mm. Coordinates in mm from the lower left corner, seen from the top.
Outline: 39,0 36.4,0 36.4,1.8 31.6,1.8 31.6,0 25.4,0 25.4,1.8 20.6,1.8 20.6,0 14.4,0 14.4,1.8 9.6,1.8 9.6,0 7,0 arc-90 0,7 0,10.6 7,10.6 7,24.4 0,24.4 0,28 arc-90 7,35 39,35 arc-90 46,28 46,7 arc-90 39,0
Copper layers (1+2*15+16): Top 0.035mm / dielectric 1.6mm / Route2 0.035mm / dielectric 0.15mm / Route15 0.035mm / dielectric 0.2mm / Bottom 0.035mm
Design rules "jlcpcb-2layers.dru *": minimum track width 0.15mm, minimum drill 0.3mm, track to track 5mil, track to pad 5mil, pad to pad 5mil, via to via 5mil, smd to smd 5mil, copper to edge 0.3mm, drill to drill 6mil, minimum pad ring 10mil, minimum via ring 3mil, stop-mask expansion 4mil, vias tented up to drill 0mil, thermal gap 10mil
tRestrict: area 38,28.2 to 45.7,34.7
bRestrict: area 38,28.2 to 46.1,35
vRestrict: area 38,28.2 to 45.7,34.7

### Footprints (pad centres in the part's own frame; a part is rotated, then mirrored left to right if it is on the bottom)
2450AT18B100E_ANTC3216X140N = smd 1.15 x 1.8: 1 -1.5,0; 2 1.5,0
NORDIC_NRF_3_RESC0201_L = smd 0.28 x 0.43: 1 -0.255,0; 2 0.255,0
NORDIC_NRF_3_RESC0402_L = smd 0.5 x 0.6: 1 -0.5,0; 2 0.5,0
GRM011R60J152KE01L_2_CAPC0201X13N = smd 0.22 x 0.23: 1 -0.185,0; 2 0.185,0
ESP32_C6_LIBRARY_5_SOD3716X135N = smd 1.15 x 0.8: 1 -1.75,0; 2 1.75,0
ESP32_C6_LIBRARY_3_SOT95P280X145-6N = smd 1.2 x 0.6: 1 -1.25,0.95; 2 -1.25,0; 3 -1.25,-0.95; 4 1.25,-0.95; 5 1.25,0; 6 1.25,0.95
BQ25180YBGR_BGA8C40P2X4_100X155X50 = smd 0.2 x 0.2: A1 -0.2,0.6; A2 0.2,0.6; B1 -0.2,0.2; B2 0.2,0.2; C1 -0.2,-0.2; C2 0.2,-0.2; D1 -0.2,-0.6; D2 0.2,-0.6
DRV2605YZFR_BGA9C50P3X3_144X144X62 = smd 0.25 x 0.25: A1 -0.5,0.5; A2 0,0.5; A3 0.5,0.5; B1 -0.5,0; B2 0,0; B3 0.5,0; C1 -0.5,-0.5; C2 0,-0.5; C3 0.5,-0.5
BMA423_BMA423 = smd 0.3 x 0.35: 1 -0.75,-0.775; 2 -0.25,-0.775; 3 0.25,-0.775; 4 0.75,-0.775; 7 0.75,0.775; 8 0.25,0.775; 9 -0.25,0.775; 10 -0.75,0.775 | smd 0.35 x 0.3: 5 0.775,-0.25; 6 0.775,0.25; 11 -0.775,0.25; 12 -0.775,-0.25
RT6160AWSC_BGA15C40P3X5_140X230X60 = smd 0.216 x 0.216: A1 -0.4,0.8; A2 0,0.8; A3 0.4,0.8; B1 -0.4,0.4; B2 0,0.4; B3 0.4,0.4; C1 -0.4,0; C2 0,0; C3 0.4,0; D1 -0.4,-0.4; D2 0,-0.4; D3 0.4,-0.4; E1 -0.4,-0.8; E2 0,-0.8; E3 0.4,-0.8
503480-2400_5034802400 = smd 0.3 x 0.7: 1 -5.75,1.525; 2 -5.25,1.525; 3 -4.75,1.525; 4 -4.25,1.525; 5 -3.75,1.525; 6 -3.25,1.525; 7 -2.75,1.525; 8 -2.25,1.525; 9 -1.75,1.525; 10 -1.25,1.525; 11 -0.75,1.525; 12 -0.25,1.525; 13 0.25,1.525; 14 0.75,1.525; 15 1.25,1.525; 16 1.75,1.525; 17 2.25,1.525; 18 2.75,1.525; 19 3.25,1.525; 20 3.75,1.525; 21 4.25,1.525; 22 4.75,1.525; 23 5.25,1.525; 24 5.75,1.525 | smd 0.3 x 1: MP1 -6.54,-1.125; MP2 6.54,-1.125
TC2030-IDC_TC2030IDC = smd 0.783 x 0.783: 1 -0.953,-0.635; 2 -0.953,0.635; 3 0.317,-0.635; 4 0.317,0.635; 5 1.588,-0.635; 6 1.588,0.635 | hole 2.451: -2.223,-2.54; -2.223,2.54; 0.952,-2.54; 0.952,2.54 | hole 1.067: -2.223,0; 2.857,-1.016; 2.857,1.016
KH-TYPE-C-16P_KINGHELM_KH-TYPE-C-16P = smd 0.6 x 1.15: A1_B12 -3.2,4.725; A4_B9 -2.4,4.725; A9_B4 2.4,4.725; A12_B1 3.2,4.725 | smd 0.3 x 1.15: A5 -1.25,4.725; A6 -0.25,4.725; A7 0.25,4.725; A8 1.25,4.725; B5 1.75,4.725; B6 0.75,4.725; B7 -0.75,4.725; B8 -1.75,4.725 | drill 0.65 pad 1.05: SH1 -4.32,0; SH2 4.32,0; SH3 -4.32,4.15; SH4 4.32,4.15 | hole 0.7: -2.89,3.65; 2.89,3.65
NORDIC_NRF_2_RESC0402_L = smd 0.5 x 0.6: 1 -0.5,0; 2 0.5,0
ESP32_C6_LIBRARY_2_IND_4828-WE-TPC_WRE = smd 0.9 x 5.3: 1 -2.286,0; 2 2.286,0
MLP2016SR47MT0S1_INDC2016X100N = smd 1.2 x 2.2: 1 -1.028,0; 2 1.028,0
ESP32_C6_LIBRARY_4_ESP32_C6_LIBRARY_4_ESP32_C6_LIBRARY_4_ESP32_C6_LIBRARY_4_ESP32_WROVER_SPARKFUN-DISCRETESEMI_SOT23-3 = smd 0.8 x 0.9: 1 -0.95,-1; 2 0.95,-1; 3 0,1.1
ESP32_C6_LIBRARY_6_SOT65P210X110-3N = smd 1.05 x 0.5: 1 -1.05,0.65; 2 -1.05,-0.65; 3 1.05,0
CPF0201D7K68C1_0201 = smd 0.35 x 0.25: 1 0,0.275; 2 0,-0.275
ERA-1AEB3401C_0201 = smd 0.35 x 0.25: 1 0,0.275; 2 0,-0.275
ESP32_C6_LIBRARY_7_JUMPER_SJ = smd 1.168 x 1.6: 1 -0.762,0; 2 0.762,0
2025-10-22_07-23-44_LIBRARY_SW_EVP-AKE31A_PAN = smd 0.711 x 1.092: 1 -1.4,-0.972; 2 1.4,-0.972 | drill 0.559 pad 0.914 square: 3 -1.848,0.381; 4 1.848,0.381 | smd 1.397 x 1.092: 5 0,-1.124
HECTOR_WATCH_1_TP20R = smd 2 x 2: TP 0,0
NORDIC_NRF_4_AQFN50P700X700X85_HS-74N = smd 4.85 x 4.85: P$74 0,0 | drill 0.3 pad 0.6: P$75 -1.8,1.8; P$76 -0.6,1.8; P$77 0.6,1.8; P$78 1.8,1.8; P$79 -1.8,0.6; P$80 -0.6,0.6; P$81 0.6,0.6; P$82 1.8,0.6; P$83 -1.8,-0.6; P$84 -0.6,-0.6; P$85 0.6,-0.6; P$86 1.8,-0.6; P$87 -1.8,-1.8; P$88 -0.6,-1.8; P$89 0.6,-1.8; P$90 1.8,-1.8 | smd 0.2 x 0.2: P$A8 -1.25,3.25; P$A10 -0.75,3.25; P$A12 -0.25,3.25; P$A14 0.25,3.25; P$A16 0.75,3.25; P$A18 1.25,3.25; P$A20 1.75,3.25; P$A22 2.25,3.25; P$A23 2.75,3.25; P$AA24 3.25,-2.25; P$AB2 -2.75,-2.5; P$AC5 -2,-2.75; P$AC9 -1,-2.75; P$AC11 -0.5,-2.75; P$AC13 0,-2.75; P$AC15 0.5,-2.75; P$AC17 1,-2.75; P$AC19 1.5,-2.75; P$AC21 2,-2.75; P$AC24 3.25,-2.75; P$AD2 -2.75,-3.25; P$AD4 -2.25,-3.25; P$AD6 -1.75,-3.25; P$AD8 -1.25,-3.25; P$AD10 -0.75,-3.25; P$AD12 -0.25,-3.25; P$AD14 0.25,-3.25; P$AD16 0.75,-3.25; P$AD18 1.25,-3.25; P$AD20 1.75,-3.25; P$AD22 2.25,-3.25; P$AD23 2.75,-3.25; P$B1 -3.25,2.75; P$B3 -2.5,2.75; P$B5 -2,2.75; P$B7 -1.5,2.75; P$B9 -1,2.75; P$B11 -0.5,2.75; P$B13 0,2.75; P$B15 0.5,2.75; P$B17 1,2.75; P$B19 1.5,2.75; P$B24 3.25,2.75; P$C1 -3.25,2.25; P$D2 -2.75,2; P$D23 2.75,2; P$E24 3.25,1.75; P$F2 -2.75,1.5; P$F23 2.75,1.5; P$G1 -3.25,1.25; P$H2 -2.75,1; P$H23 2.75,1; P$J1 -3.25,0.75; P$J24 3.25,0.75; P$K2 -2.75,0.5; P$L1 -3.25,0.25; P$L24 3.25,0.25; P$M2 -2.75,0; P$N1 -3.25,-0.25; P$N24 3.25,-0.25; P$P2 -2.75,-0.5; P$P23 2.75,-0.5; P$R1 -3.25,-0.75; P$R24 3.25,-0.75; P$T2 -2.75,-1; P$T23 2.75,-1; P$U1 -3.25,-1.25; P$U24 3.25,-1.25; P$V23 2.75,-1.5; P$W1 -3.25,-1.75; P$W24 3.25,-1.75; P$Y2 -2.75,-2; P$Y23 2.75,-2
ESP32_C6_LIBRARY_SON50P200X200X80-9N = smd 0.76 x 0.27: 1 -0.985,0.75; 2 -0.985,0.25; 3 -0.985,-0.25; 4 -0.985,-0.75; 5 0.985,-0.75; 6 0.985,-0.25; 7 0.985,0.25; 8 0.985,0.75 | smd 0.9 x 1.3: 9 0,0
NORDIC_NRF_BT-XTAL_2016_N = smd 0.95 x 0.85: 1 -0.725,-0.575; 2 0.725,-0.575; 3 0.725,0.575; 4 -0.725,0.575
NORDIC_NRF_1_XTAL_3215_N = smd 1 x 1.8: 1 -1.25,0; 2 1.25,0

### Placement (x,y rotation side)
ANT1  40.92,31.48 0 top
C1  36.68,21.08 0 top
C1-EP-DR  12.73,18.82 90 top
C2  36.1,25.42 0 top
C2-EP-DR1  17.03,8.85 270 top
C3  39.05,25.18 270 top
C4  40.22,25.15 270 top
C5  26.85,23.46 270 top
C6  23.71,13.98 0 top
C7  24.21,11.75 0 top
C8  32.85,9.3 270 top
C9  35.78,19.52 0 top
C10  32.7,25.05 180 top
C11  36.19,24.68 0 top
C12  28.38,25.12 90 top
C13  33.72,25.33 270 top
C14  24.18,10.93 0 top
C15  31.55,25.4 90 top
C16  32.51,26.22 90 top
C17  16.54,15.7 90 top
C18  20.24,20.24 0 top
C19  24.16,12.91 0 top
C20  30.84,13.51 0 top
C21  25.47,15 0 top
C22  41.33,25.16 270 top
C23  32.08,11.64 89.8 top
C24  30.26,9.93 0 top
C25  34.54,13.8 0 top
C27  23.92,6.59 270 top
C29  33.42,5.52 0 top
C30  11.76,5.73 0 top
C31  22.19,5.23 0 top
C32  22.68,10.79 0 top
C33  25.9,11.33 270 top
C34  15.1,18.15 270 top
C37  30.29,11.24 90 top
C38  23.94,15.19 90 top
C39  32.69,13.16 180 top
C42  26.1,25.83 0 top
C43  26.1,27.17 0 top
D2  17.2,10.32 0 top
D3  23.3,23.99 270 top
D4  16.98,11.88 180 top
D5  17.03,8.83 180 top
EPD_C1  12.86,20.36 180 top
EPD_C2  12.8,21.57 180 top
EPD_C5  12.32,15.21 0 top
EPD_C6  13.54,14.35 180 top
EPD_C7  13.01,13.44 180 top
EPD_C8  12.93,12.53 180 top
EPD_C9  8.84,9.74 0 top
EPD_C10  10.9,9.76 180 top
EPD_C11  13.09,11.44 180 top
EPD_C12  13.11,10.17 180 top
IC1  29.22,12.65 0.4 top
IC2  22.67,9.59 0 top
IC3  21.8,17.8 90 top
IC9  33.09,11.39 0 top
J1  9.72,17.5 270 top
J2  41.56,14.86 0 top
J4  22.65,33.33 180 top
L1  40.26,26.69 0 top
L2  29.35,25.04 270 top
L3  30.37,24.99 90 top
L5  16.44,22.82 270 top
L7  36.66,11.72 270 top
Q1  13.45,16.15 90.5 top
Q3  13.95,26.92 0 top
R1_EP_DR  18.73,13.12 180 top
R1_USB  25.02,31.79 270 top
R2  31.99,10.33 90 top
R2_EP_DR  19.19,27.35 270 top
R2_USB  20.62,31.73 270 top
R3  22.08,14.64 89.8 top
R4  31.64,10.86 90 top
R5  14.57,5.49 180 top
R7  32.17,5.61 180 top
R8  20.55,5.21 0 top
R9  29.3,11.28 270 top
R17  21.26,15.32 180 top
R18  22.8,15.82 180 top
R_PWR_EPD  15.28,16.14 180 top
R_TYPE_SEL  19.51,13.11 0 top
SJ1  16.38,13.43 0 top
SW_DN  34.08,3.05 180.1 top
SW_ENT  22.83,2.85 180 top
SW_UP  11.85,2.85 180 top
TP1  33.61,15.83 0 top
TP2  36.53,16.6 0 top
TP3  44.24,21.79 0 top
TP4  30.9,15.77 0 top
TP5  36.04,27.46 0 top
TP6  39.62,8.52 0 top
TP_3V3  21.05,12.23 0 top
TP_BAT_GND  44.3,8.54 0 top
TP_ON  25.21,8.24 0 top
TP_OP  27.98,6.58 0 top
TP_SCL  18.69,15.54 0 top
TP_SDA  25.42,17.85 0 top
TP_VBAT  25.35,5.63 0 top
TP_VREG  30.25,8.43 0 top
U1  31.42,20.57 0 top
U3  21.83,7.27 180 top
X1  36.67,22.94 0 top
X2  17.59,18.87 180 top

### Tracks (layer width: path | path; a pad name or v marks a point on that pad's centre or on a via)
3V3/1.7D  (via drill 0.35)
  Top 0.305: R5.2 15.07,5.77 16.88,3.96 19.9,3.96 | 19.9,3.96 20.27,3.96 20.79,4.47 20.79,4.7 R8.2 | v15.9,14.85 15.93,14.82 15.94,14.83 15.94,16.35 15.88,16.42 R_PWR_EPD.2 15.13,16.42 Q1.2 14.58,17.11 15.1,17.63 C34.2 | v19.29,5.53 19.9,4.93 19.9,3.96 | IC2.C2 22.67,8.76 22.89,8.53 23.74,8.53 v23.8,8.47 | v30.5,5.31 31.08,5.89 R7.2
  Route2 0.305: v30.5,5.31 29.06,5.31 25.9,8.47 v23.8,8.47 20.87,5.53 v19.29,5.53
  Bottom 0.305: v15.9,14.85 20.74,10 20.74,5.96 20.31,5.53 v19.29,5.53
3V3/2.4A  (via drill 0.35)
  Top 0.305: U1.P$B1 28.17,24.66 C12.1 27.84,24.87 27.57,25.14 27.57,26.1 28.32,26.85 | IC3.3 23.29,18.05 v23.51,17.82 | IC3.7 20.52,18.55 19.72,17.75 19.72,16.82 | C19.1 23.26,13.55 23.25,13.54 | 23.25,13.54 23.21,13.57 C6.1 23.21,14.04 22.8,14.45 22.8,14.99 | v30.53,14.4 30.68,14.26 31.8,14.26 32.25,13.8 33.03,13.8 | 28.32,26.85 v28.29,26.88 | U1.P$A22 33.67,23.95 34.79,25.06 v34.79,25.49 34.79,26.2 TP5.TP | 21.15,14.76 | 21.15,14.76 21.26,14.87 R17.1 21.08,15.04 19.59,16.53 19.59,16.69 19.72,16.82 | R18.1 22.8,14.99 | 22.8,14.99 | U1.P$Y2 28.52,18.57 27.95,18 v27.8,18 27.8,18.44 U1.P$W1 27.99,18.82 27.38,19.43 v24.97,19.43 | 34.15,17.29 U1.P$AD23 34.17,17.2 35.33,16.05 35.33,14.86 | C25.1 34.05,13.82 34.05,14.46 34.26,14.66 35.13,14.66 35.33,14.86 | 33.03,13.8 C25.1 | IC9.E3 33.51,10.57 | C8.1 33.09,9.79 IC9.E2 IC9.E3 | C25.1 34.04,13.09 v33.93,12.98 | v34.19,10.23 33.85,10.23 IC9.E3 | U1.P$AD14 31.67,16.84 32.3,16.22 32.3,14.56 32.42,14.43 32.6,14.43 33.03,14 33.03,13.8 | 20.98,12.23 TP_3V3.TP 21.9,13.08 v22.17,13.08 | J2.1 40.35,13.96 36.23,13.96 35.33,14.86 | C19.1 23.94,12.88 | v22.17,13.08 22.79,13.08 23.25,13.54 | 21.15,14.76 21.15,14.1 v22.17,13.08 | IC3.10 20.97,16.99 19.89,16.99 19.72,16.82 | C19.1 23.97,12.85 23.97,12.3 | C14.1 23.68,11.47 C7.1 23.95,12.3 23.97,12.3 | C33.1 25.43,12.3 23.97,12.3 | v29.2,28.01 28.32,27.13 28.32,26.85
  Route2 0.305: v33.93,12.98 33.93,10.83 34.19,10.57 v34.19,10.23 | v24.97,19.43 24.97,23.05 21.95,26.07 21.95,27.71 22.27,28.03 29.2,28.03 v29.2,28.01
  Bottom 0.305: 27.8,17.89 27.94,18.03 28.84,18.03 30.53,16.34 v30.53,14.4 | 27.8,17.89 25.63,15.72 | 25.63,15.72 25.49,15.59 | 25.49,15.59 22.98,13.08 v22.17,13.08 | v28.29,26.88 28.59,27.17 33.93,27.17 34.79,26.32 v34.79,25.49 | 25.48,15.59 25.49,15.59 | 25.63,15.72 25.06,15.72 23.51,17.27 v23.51,17.82 | v27.8,18 27.8,17.89
DN
  Top 0.152: J4.B7 23.4,26.71 | 23.4,26.71 24.25,25.86 D3.1 | J4.A7 22.4,27.5 22.59,27.32 22.79,27.32 23.4,26.71
DP
  Top 0.152: D3.3 21.9,25.69 J4.B6 21.9,29.79 22.18,30.07 22.7,30.07 22.9,29.87 J4.A6
EPD_3V3
  Top 0.305: J1.16 J1.15 11.35,16.14 Q1.3 | L5.2 15.3,20.54 14,19.23 14,18.03 12.34,16.38 Q1.3 | Q1.3 12.57,15.92 EPD_C5.2 | Q1.3 12.34,17.93 C1-EP-DR.1
GDR
  Top 0.305: 12.47,27.57 Q3.1 | J1.2 11.86,22.75 12.06,22.95 12.06,27.36 12.26,27.57 Q3.1 | R2_EP_DR.2 16.05,27.35 15.65,27.76 13.09,27.76 Q3.1
GND  (via drill 0.35)
  Top 0.305: J4.A1_B12 26.42,29.18 J4.SH3 | J4.A12_B1 19.45,27.37 R2_EP_DR.1 | IC3.8 IC3.9 20.97,17.6 v20.4,17.6 | U1.P$B7 29.92,22.67 U1.P$75 | U1.P$F23 33.52,22.07 U1.P$78 | C2.2 36.45,25.33 C11.2 36.45,24.18 35.95,23.68 X1.4 35.95,23.72 v36.98,24.75 | C42.2 26.42,25.77 26.42,25.09 26.45,25.05 v26.62,25.05 | v22.74,26.44 22.74,26.39 23.3,25.83 D3.2 | IC1.D2 29.42,11.52 29.58,11.37 R9.1 | 23.96,14.23 C6.2 23.94,14.25 C38.1 | C9.2 36.71,19.52 36.72,19.51 36.89,19.51 v36.98,19.59 | v37.56,21.02 37,21.02 C1.2 | C20.2 31.83,13.51 C39.2 | 32.16,13.18 C39.2 | TP_BAT_GND.TP 45.01,9.25 45.01,12.04 45.44,12.47 45.44,14.2 44.78,14.86 43.91,14.86 43.27,14.22 J2.5 J2.3 | 24.45,12.88 C19.2 24.83,12.91 25.93,14.01 v26.5,14.01 | v20.16,21.55 19.12,22.59 16.01,22.59 | C18.1 19.64,20.24 | v21.84,15.2 21.77,15.12 21.77,14.5 21.81,14.46 | R3.1 21.81,14.46 | EPD_C5.1 11.28,15.21 J1.17 | J1.MP2 8.34,10.7 EPD_C9.1 8.34,8.25 8.76,7.83 10.98,7.83 11.4,8.24 | J1.8 12.3,19.75 C1-EP-DR.2 12.75,19.32 13.43,18.64 v13.43,18.48 | C25.2 35.04,12.98 v34.81,12.75 | 35.01,11.4 v35.1,11.48 34.98,11.37 33.52,11.37 33.5,11.39 IC9.C3 IC9.C2 IC9.C1 | C30.2 13.15,6.61 v13.34,6.61 12.5,6.61 11.4,7.71 EPD_C10.1 | v14.35,4.12 14.05,3.83 SW_UP.1 | C14.2 24.46,11.14 C7.2 | v26.71,10.04 v26.7,10.04 C33.2 | R_TYPE_SEL.1 19.97,13.84 20.03,13.84 20.05,13.86 v20.05,13.94 | v22.44,13.98 22.29,13.98 21.81,14.46 | X1.2 38.04,21.73 v38.04,21.51 | EPD_C2.1 13.3,20.43 EPD_C1.1 | U1.P$74 U1.P$84 | IC9.C1 32.14,11.39 | IC9.B1 IC9.C1 | C27.2 23.6,6.02 23.14,6.02 22.82,6.34 U3.1 | IC2.B3 24.09,9.59 24.62,9.59 v24.66,9.63 | IC2.B1 21.9,9.59 21.7,9.4 v21.32,9.4 | C37.1 29.92,10.69 29.76,10.69 v29.76,10.64
  Top 0.305: v31.47,11.59 31.54,11.66 | C39.2 32.14,13.16 31.47,12.49 v31.47,11.59 | v31.47,11.59 31.68,11.38 C23.1 | C34.1 15.1,19.09 v15.13,19.13 | SJ1.1 15.62,13.74 16.55,14.67 C17.1 | U3.4 22.22,8.02 21.83,7.63 U3.9 21.58,7.52 U3.6
  Route2 0.305: v26.62,25.05 25.87,25.05 24.48,26.44 v22.74,26.44 | v20.16,21.55 20.16,19.92 20.4,19.68 v20.4,17.6 20,18 15.91,18 15.71,17.8 15.71,16.41 19.22,12.89 20.47,12.89 20.59,13.01 20.59,14.83 20.89,15.13 21.78,15.13 v21.84,15.2 | v34.81,12.75 34.81,11.77 v35.1,11.48 | v13.34,6.61 13.34,5.37 14.35,4.35 v14.35,4.12 | v20.05,13.94 20.23,14.12 22.3,14.12 v22.44,13.98 | v38.04,21.51 38.04,23.19 36.98,24.25 v36.98,24.75 | v15.13,19.13 13.48,19.13 13.13,18.78 v13.43,18.48 | v13.43,18.48
  Bottom 0.305: v36.98,19.59 36.98,19.84 37.73,20.59 37.73,20.85 v37.56,21.02 | v26.5,14.01 26.71,13.8 v26.71,10.04 | v29.76,10.64 30.76,9.64 30.76,9.15 30.9,9.01 32.28,9.01 32.95,9.68 32.95,9.95 31.47,11.43 v31.47,11.59 | v24.66,9.63 24.66,10.63 24.68,10.65 | 24.68,10.65 | 24.68,10.65 24.16,11.16 23.28,11.16 21.51,9.4 v21.32,9.4
  pour Top: -1.4,-1 49.88,-1 49.88,36.63 -1.4,36.63
  pour Route2: -1.4,-1 49.88,-1 49.88,36.63 -1.4,36.63
  pour Route15: -1.4,-1 49.88,-1 49.88,36.63 -1.4,36.63
  pour Bottom: -1.4,-1 49.88,-1 49.88,36.63 -1.4,36.63
IMU_INT1  (via drill 0.35)
  Top 0.15: IC3.5 22.05,18.88 22.38,19.22 23.19,19.22 v23.24,19.27 | U1.P$N1 28.17,20.26 28.14,20.23 23.94,20.23 v23.69,20.47
  Bottom 0.15: v23.69,20.47 23.15,19.93 23.15,19.31 23.19,19.27 v23.24,19.27
IMU_INT2
  Top 0.15: IC3.6 21.55,19.39 21.68,19.52 22.57,19.52 22.97,19.93 28.53,19.93 U1.P$P2
LX1
  Top 0.305: L7.1 36.02,12.1 33.99,12.1 33.72,11.83 33.52,11.83 IC9.B3 IC9.B2
LX2
  Top 0.305: L7.2 36.45,10.91 33.57,10.91 IC9.D3 IC9.D2
N$1
  Top 0.152: U1.P$C1 27.69,22.82 27.61,22.9 27.61,23.4 27.3,23.72 C5.1 27,23.72
N$2
  Top 0.15: U1.P$N24 34.73,20.32 C9.1
N$3
  Top 0.15: U1.P$D23 34.17,23.35 35.5,24.68 C11.1
N$4
  Top 0.15: IC9.D1 32.05,10.99 R4.2
N$5  (via drill 0.35)
  Top 0.15: U1.P$D2 28.57,22.47 v26.27,22.47 | C17.2 16.92,16.32 v16.92,16.55 16.92,17.16 16.41,17.67 16.41,18.79 X2.2
  Route2 0.15: v26.27,22.47 26.27,17.48 24.59,15.8 17.73,15.8 16.98,16.55 v16.92,16.55
N$6
  Top 0.15: U1.P$F2 28.59,22.15 27.24,22.15 26.13,21.03 20.88,21.03 | 18.84,19.38 18.84,19.03 | 18.84,19.03 X2.1 | 20.88,21.03 20.5,20.66 C18.2 20.5,19.43 20.1,19.03 18.84,19.03 | 20.88,21.03
N$7  (via drill 0.35)
  Top 0.15: C2-EP-DR1.2 16.95,8.27 15.99,8.27 15.43,8.83 D5.2 13.3,8.83 v13.12,9.01 | v13.47,22.46 16.16,25.15 16.44,25.15
  Top 0.305: Q3.3 16.44,25.48 16.44,25.15 L5.1
  Bottom 0.15: v13.12,9.01 12.91,9.21 12.91,21.9 v13.47,22.46
N$9
  Top 0.152: U1.P$H23 34.3,21.7 34.93,21.7 35.3,21.32 35.3,20.78 35.64,20.44 37.79,20.44 38.59,21.24 38.59,25.41 38.61,25.44 C3.1 39.05,25.98 L1.1
N$10
  Top 0.15: C4.1 C22.1
  Top 0.152: C22.1 41.33,26.13 L1.2 39.42,28.03 ANT1.1
N$12  (via drill 0.35)
  Top 0.15: U1.P$B5 29.42,23.59 30.33,24.49 L3.1 31.14,24.49 C15.1 31.7,25.05 32.17,25.05 | C16.1 32.51,25.12 C10.2 32.17,25.05 | U1.P$E24 34.67,22.79 v34.68,22.8 | v32.17,24.36 32.17,25.05
  Bottom 0.15: v34.68,22.8 32.97,24.51 32.33,24.51 v32.17,24.36
N$13
  Top 0.15: X1.3 37.48,23.6 37.48,25.65 37.18,25.96 35.97,25.96 35.85,25.83 C2.1 35.69,25.42 34.17,23.9 U1.P$A23
N$14
  Top 0.152: C1.1 35.95,21.55 X1.1 35.82,22.36 34.87,23.32 U1.P$B24
N$15
  Top 0.15: L2.1 30.32,25.54 L3.2
N$16
  Top 0.15: U1.P$B3 28.92,24.11 L2.2
N$17
  Top 0.15: U1.P$A18 32.71,23.82 32.71,24.27 32.96,24.53 33.7,24.53 33.72,24.55 C13.2
N$18
  Top 0.15: R3.2 22.32,14.67 22.32,16.45 22.58,16.7 IC3.1
N$19
  Top 0.15: U1.P$AC5 29.26,17.82 28.94,17.5 28.94,14.93 29.91,13.97 29.91,13.95 C20.1
N$21
  Top 0.15: IC9.E1 32.42,10.33 R2.2
N$23
  Top 0.15: J1.20 11.72,13.75 11.85,13.62 11.85,13.08 12.4,12.53 EPD_C8.2
N$24
  Top 0.15: IC1.D1 29.02,11.29 R9.2
N$25
  Top 0.15: C2-EP-DR1.1 18,10.32 18.91,10.32 | 18.91,10.32 D2.2 | D4.1 18.91,11.7 18.91,10.32
N$27
  Top 0.15: EPD_C2.2 11.99,21.57 11.78,21.78 11.27,21.78 J1.4
N$29
  Top 0.15: SJ1.2 17.73,12.84 R1_EP_DR.1 18.74,12.83 R_TYPE_SEL.2
N$31
  Top 0.15: J1.5 11.59,21.25 12.36,20.48 EPD_C1.2
N$32
  Top 0.15: IC2.A2 22.67,10.42 22.86,10.61 C32.2
N$34
  Top 0.152: R2_USB.1 J4.B5
N$37
  Top 0.152: J4.A5 23.9,30.94 R1_USB.2
N$39
  Top 0.15: J1.19 11.72,14.25 11.92,14.05 12.2,14.05 12.51,13.75 EPD_C7.2
N$41
  Top 0.15: EPD_C6.2 13.01,14.39 12.03,14.39 11.67,14.75 J1.18
N$42
  Top 0.15: J1.23 11.28,12.21 11.81,12.21 11.91,12.12 11.91,11.74 12.2,11.44 EPD_C11.2
N$44
  Top 0.15: J1.24 11.24,11.07 12.14,10.17 EPD_C12.2
OUT+
  Top 0.305: IC2.A3 24.19,10.09 24.33,10.23 25.66,10.23 26.53,9.36 26.53,8.03 TP_OP.TP
OUT-
  Top 0.305: TP_ON.TP 24.36,9.09 IC2.C3
P0.13/1.5D
  Top 0.15: R5.1 12.97,5.21 12.62,4.87 11.58,4.87 11.27,5.18 | SW_UP.2 10.45,4.37 11.27,5.18 | C30.1 11.27,5.18
P0.14/1.5D
  Top 0.305: SW_ENT.2 21.69,4.08 C31.1 21.41,5.23 21.15,5.48 R8.1
P1.01/1.6C
  Top 0.15: R_PWR_EPD.1 15.28,15.45 15.04,15.21 Q1.1
P1.02/1.6C
  Top 0.15: C29.1 32.36,5.52 R7.1 32.17,4.53 SW_DN.2
PMIC_INT  (via drill 0.35)
  Top 0.15: U1.P$T2 28.67,19.13 v28.64,19.1 | v28.58,13.83 29.01,13.4 IC1.A1
  Bottom 0.15: v28.58,13.83 30.75,13.83 31.18,14.25 31.18,16.96 30.47,17.67 29.77,17.67 28.64,18.8 v28.64,19.1
PREVGH  (via drill 0.35)
  Top 0.305: J1.21 9.59,13.24 9.42,13.07 9.42,9.83 EPD_C9.2 9.34,9.23 v9.06,8.96 | v20.12,8.71 18.89,8.71 D5.1
  Bottom 0.305: v9.06,8.96 10.77,7.25 19.91,7.25 20.25,7.59 20.25,8.58 v20.12,8.71
PREVGL  (via drill 0.35)
  Top 0.305: J1.22 10.44,12.75 10.14,12.45 10.14,10.02 EPD_C10.2 10.4,9.04 v10.34,8.97 | v14.5,10.97 14.5,11.16 D4.2
  Bottom 0.305: v10.34,8.97 11.35,7.96 13.48,7.96 14.28,8.77 14.28,10.75 v14.5,10.97
RESE  (via drill 0.35)
  Top 0.305: Q3.2 v12.9,24.03 12.9,22.82 12.33,22.25 J1.3 | v19.13,14.05 19.13,13.79 R1_EP_DR.2
  Bottom 0.305: v12.9,24.03 15.57,24.03 18.18,21.42 18.18,14.92 19.05,14.05 v19.13,14.05
RESET  (via drill 0.35)
  Top 0.15: U1.P$AC13 30.9,17.29 TP4.TP 30.32,15.77 v29.56,16.52 | v42.5,14.78 43.15,15.43 J2.6
  Route2 0.15: v29.56,16.52 29.56,11.74 30.84,10.46 32.27,10.46 32.76,9.97 32.76,9.49 33.31,8.95 43.08,8.95 45.35,11.22 45.35,14.31 44.82,14.83 42.56,14.83 v42.5,14.78 42.57,14.85
SCL/1.4C  (via drill 0.35)
  Top 0.15: IC2.C1 21.87,8.79 v21.87,8.65 | v18.08,6.21 18.89,7.02 U3.7
  Bottom 0.15: v21.87,8.65 22.06,8.46 22.06,5.37 21.1,4.41 19.63,4.41 18.04,6 18.04,6.17 v18.08,6.21
SCL/2.4C  (via drill 0.35)
  Top 0.15: U1.P$M2 27.21,20.57 v27.07,20.71 | v18.94,17.2 18.69,16.94 TP_SCL.TP | IC3.12 22.05,16.63 21.66,16.25 21.44,16.25 21.2,16.01 21.2,15.65 R17.2 21.26,16.25 v21.41,16.41 | IC1.B1 27.94,12.85 27.64,13.14 v27.8,13.3 27.4,13.3 26.87,12.77 26.87,11.52 27.48,10.92 27.48,9.08 29.45,7.11 31.09,7.11 31.58,7.6 31.58,8.91 31.31,9.18 31.31,10.81 R4.1
  Route2 0.15: v21.41,16.41 19.73,16.41 v18.94,17.2 | v27.8,13.3 27.8,16.91 28.47,17.58 28.47,18.18 27.07,19.58 v27.07,20.71
  Bottom 0.15: v27.07,20.71 24.67,18.31 20.17,18.31 19.06,17.2 v18.94,17.2
SDA/1.4C  (via drill 0.35)
  Top 0.305: U3.8 v19.69,6.52 v19.68,6.53 | IC2.B2 22.6,9.59 22.26,9.93 21.73,9.93 v21.33,10.33
  Route2 0.305: v19.69,6.52 19.69,7.27 19.08,7.88 19.08,9.83 19.88,10.63 21.03,10.63 v21.33,10.33
SDA/2.4C  (via drill 0.35)
  Top 0.15: IC3.2 22.73,17.55 22.98,17.3 | 22.98,17.3 22.98,16.52 22.8,16.34 R18.2 | R18.2 | U1.P$L1 28.04,20.82 27.54,21.31 v27.54,21.49 | 24.78,18.49 TP_SDA.TP | TP_SDA.TP 24.87,17.3 22.98,17.3 | IC1.C1 v27.36,12.45 28.04,11.77 28.04,11.25 v28.08,11.25 | v26.94,18.8 26.37,18.8 TP_SDA.TP | v31.82,9.58 31.71,9.69 R2.1 | v24.23,18.79 24.48,18.79 TP_SDA.TP
  Route2 0.15: v27.36,12.45 27.19,12.62 27.19,18.55 v26.94,18.8
  Bottom 0.15: v27.54,21.49 27.15,21.88 27.15,23.1 26.84,23.41 25.67,23.41 24.23,21.97 v24.23,18.79 | v31.82,9.58 31.82,10.07 30.64,11.25 29.92,11.25 v28.08,11.25
SWDCLK
  Top 0.15: TP3.TP 42.06,19.61 41.56,19.61 | 41.56,19.61 37.94,19.61 36.65,18.32 U1.P$AA24 | J2.4 40.96,16.41 40.96,19.01 41.56,19.61
SWDIO
  Top 0.15: U1.P$AC24 35.89,16.6 TP2.TP 37.34,15.79 40.31,15.79 J2.2
SWO
  Top 0.15: U1.P$AD22 33.67,16.5 33.61,16.43 TP1.TP
VBAT/1.2A
  Top 0.305: 25.35,6.17 25.35,5.91 | 25.35,5.91 TP_VBAT.TP | U3.3 U3.2 23.74,7.02 C27.1 24.42,6.84 25.35,5.91
VBAT/2.5C
  Top 0.305: IC1.C2 29.66,12.45 30.29,11.82 C37.2
VBUS/1.5D
  Top 0.305: 24.88,28.77 J4.A4_B9 25.05,27.4 25.28,27.17 C43.1 25.6,26.08 C42.1 25.84,24.54 25.52,24.22 23.44,24.22 23.3,24.08 D3.5 23.19,22.63 23.19,22.24 22.57,21.62 21.15,21.62 20.1,22.67 20.1,27.65 20.25,27.8 J4.A9_B4
VBUS/2.6D
  Top 0.305: 28.03,16.38 24.21,16.38 23.89,16.05 23.89,15.43 C38.2 24.47,15.38 24.91,14.94 C21.1 | IC1.A2 29.41,13.92 28.41,14.92 28.3,14.92 28.3,16.1 28.03,16.38 | U1.P$AD2 28.53,17.18 28.53,16.88 28.03,16.38
VREG  (via drill 0.35)
  Top 0.305: IC1.B2 29.96,12.85 30.02,12.79 | 32.67,12.17 IC9.A1 IC9.A2 | 32.67,12.17 32.36,12.17 C23.2 | C24.2 | C24.2 30.76,8.93 TP_VREG.TP | 30.02,12.79 30.33,12.48 | C24.2 30.76,11.45 | 30.75,11.46 30.76,11.45 | 30.76,11.45 30.76,12.56 v30.98,12.79 30.02,12.79 | v32.2,12.43 32.41,12.43 32.67,12.17 | IC9.A3 IC9.A2 | C39.1 33.18,12.29 IC9.A2
  Bottom 0.305: v30.98,12.79 v30.99,12.8 31.68,12.8 32.05,12.43 v32.2,12.43

### Text on the board
tPlace: 3V3/1.4A | SWDCLK | SDA/2.4C | RESET | SWO | SWDIO | 3V3/1.4A | OUT- | VREG | GND | GND | VBAT/1.2A | OUT+